# EAGLE design ECU_Board_itr1_v8_2025 (EAGLE 9.6.2)

## Sheet 1 of 3
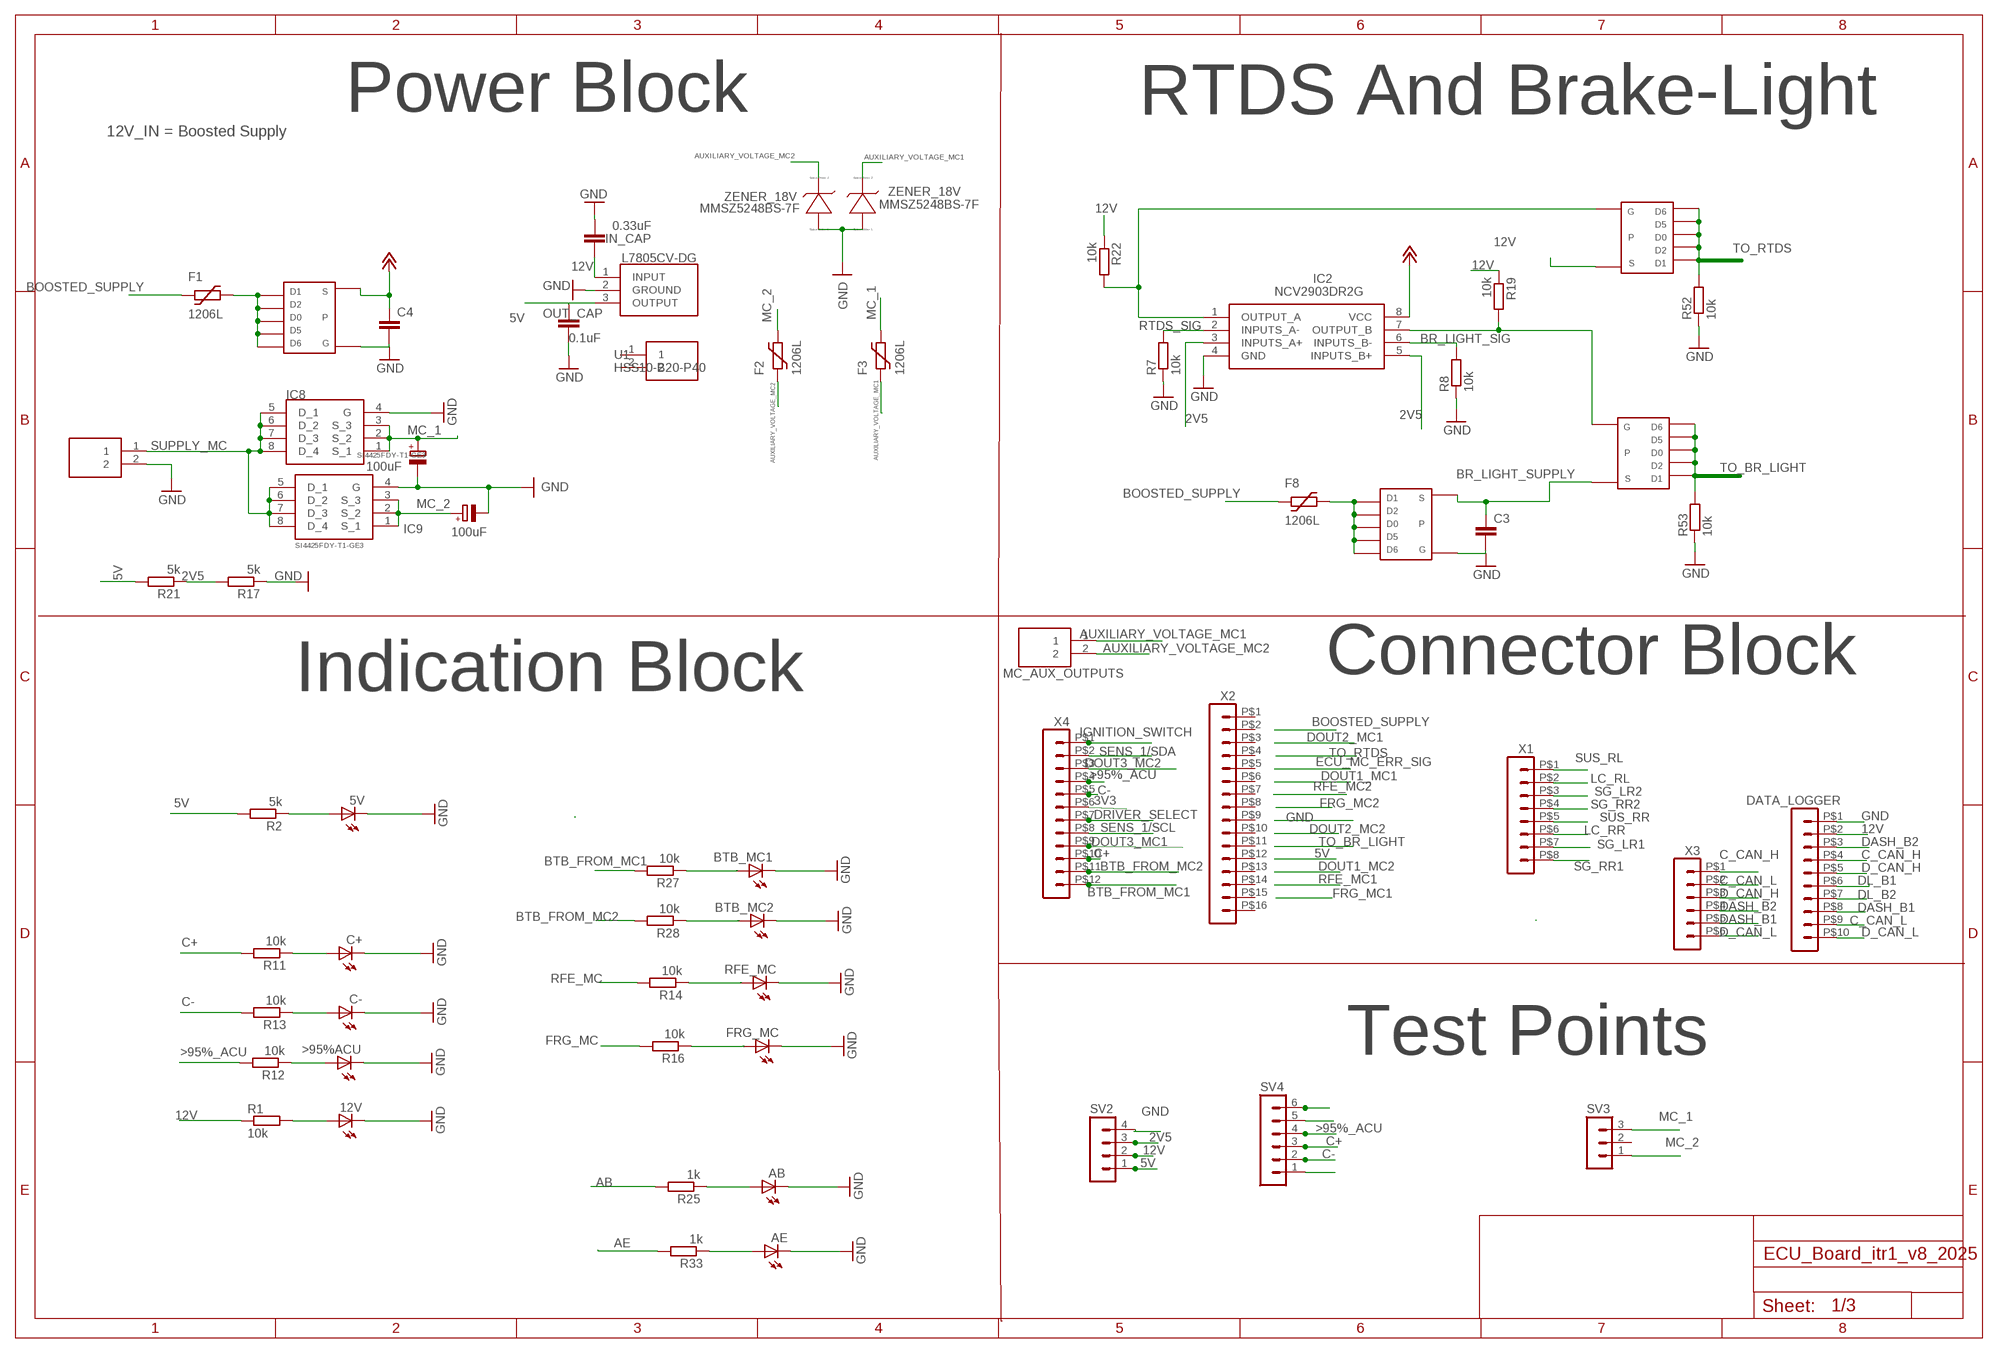
[diagram p0: schematic, sheet 1]

### Parts
5V  LED-FKIT-1206  [FKIT-LED-1206]
12V  LED-FKIT-1206  [FKIT-LED-1206]
>95%ACU  LED-FKIT-1206  [FKIT-LED-1206]
AB  LED-FKIT-1206  [FKIT-LED-1206]
AE  LED-FKIT-1206  [FKIT-LED-1206]
BOOSTED_SUPPLY1  172447-0002  [172447-YY02]
BTB_MC1  LED-FKIT-1206  [FKIT-LED-1206]
BTB_MC2  LED-FKIT-1206  [FKIT-LED-1206]
C3  C-EUC0805  [C0805]
C4  C-EUC0805  [C0805]
C7  100uF  CPOL-EUE2.5-6  [E2,5-6]
C8  100uF  CPOL-EUE2.5-6  [E2,5-6]
C+  LED-FKIT-1206  [FKIT-LED-1206]
C-  LED-FKIT-1206  [FKIT-LED-1206]
D4  ZENER  [SOD123]
D5  ZENER  [SOD123]
DATA_LOGGER  HEADER_POS10_43045-1012  [43045-1012]
F1  1206L  [1206L]
F2  1206L  [1206L]
F3  1206L  [1206L]
F8  1206L  [1206L]
FRG_MC  LED-FKIT-1206  [FKIT-LED-1206]
IC2  NCV2903DR2G  [SOIC127P600X175-8N]
IC4  L7805CV-DG  [TO255P460X1020X2008-3P]
IC8  SI4425FDY-T1-GE3  [SOIC127P600X175-8N]
IC9  SI4425FDY-T1-GE3  [SOIC127P600X175-8N]
IN_CAP  0.33uF  C-EUC0805  [C0805]
MC_AUX_OUTPUTS  172447-0002  [172447-YY02]
OUT_CAP  0.1uF  C-EUC0805  [C0805]
R1  10k  R-EU_R0805  [R0805]
R2  5k  R-EU_R0805  [R0805]
R7  10k  R-EU_R0805  [R0805]
R8  10k  R-EU_R0805  [R0805]
R11  10k  R-EU_R0805  [R0805]
R12  10k  R-EU_R0805  [R0805]
R13  10k  R-EU_R0805  [R0805]
R14  10k  R-EU_R0805  [R0805]
R16  10k  R-EU_R0805  [R0805]
R17  5k  R-EU_R0805  [R0805]
R19  10k  R-EU_R0805  [R0805]
R21  5k  R-EU_R0805  [R0805]
R22  10k  R-EU_R0805  [R0805]
R25  1k  R-EU_R0805  [R0805]
R27  10k  R-EU_R0805  [R0805]
R28  10k  R-EU_R0805  [R0805]
R33  1k  R-EU_R0805  [R0805]
R52  10k  R-EU_R0805  [R0805]
R53  10k  R-EU_R0805  [R0805]
RFE_MC  LED-FKIT-1206  [FKIT-LED-1206]
SV2  MA04-1  [MA04-1]
SV3  MA03-1  [MA03-1]
SV4  MA06-1  [MA06-1]
U1  HSS10-B20-P40  [HSS10B20P40]
U$1  TSOP-6_PMOS  [TSOP-6_PMOS]
U$13  TSOP-6_PMOS  [TSOP-6_PMOS]
U$16  TSOP-6_PMOS  [TSOP-6_PMOS]
U$17  TSOP-6_PMOS  [TSOP-6_PMOS]
X1  HEADER_POS8_44769-0801  [44769-0801]
X2  HEADER_POS16_44769-1601  [44769-1601]
X3  HEADER_POS6_43045-0612  [43045-0612]
X4  HEADER_POS12_44769-1201  [44769-1201]

### Nets
2V5: IC2.3(INPUTS_A+) IC2.5(INPUTS_B+) R17.2 R21.1 SV2.3 ; also sheet 2
3V3: SV4.1 X4.P$6 ; also sheet 2,3
5V: IC4.3(OUTPUT) OUT_CAP.1 R2.2 R21.2 SV2.1 ; also sheet 2
12V: C4.1 DATA_LOGGER.P$2 IC2.8(VCC) IC4.1(INPUT) IN_CAP.1 R1.1 R19.1 R22.1 SV2.2 U$13.S U$16.S ; supply symbol labelled +12V ; also sheet 2
>95%_ACU: R12.2 SV4.4 X4.P$4 ; also sheet 2
AB: R25.2 ; also sheet 2
AE: R33.2 ; also sheet 2
AUXILIARY_VOLTAGE_MC1: D4.C(-) F3.P$1 MC_AUX_OUTPUTS.1
AUXILIARY_VOLTAGE_MC2: D5.C(-) F2.P$1 MC_AUX_OUTPUTS.2
BOOSTED_SUPPLY: F1.P$1 F8.P$1
BR_LIGHT_SIG: IC2.6(INPUTS_B-) R8.2 ; also sheet 2
BR_LIGHT_SUPPLY: C3.1 U$1.S U$17.S
BTB_FROM_MC1: R27.2 X4.P$12 ; also sheet 2
BTB_FROM_MC2: R28.2 X4.P$11 ; also sheet 2
C+: R11.2 SV4.3 X4.P$10 ; also sheet 2
C-: R13.2 SV4.2 X4.P$5 ; also sheet 2
C_CAN_H: DATA_LOGGER.P$4 X3.P$1 ; also sheet 2
C_CAN_L: DATA_LOGGER.P$9 X3.P$2 ; also sheet 2
D_CAN_H: DATA_LOGGER.P$5 X3.P$3 ; also sheet 2
D_CAN_L: DATA_LOGGER.P$10 X3.P$6 ; also sheet 2
DASH_B1: DATA_LOGGER.P$8 X3.P$5
DASH_B2: DATA_LOGGER.P$3 X3.P$4
DL_B1: DATA_LOGGER.P$6 ; also sheet 2
DL_B2: DATA_LOGGER.P$7 ; also sheet 2
DOUT3_MC1: SV4.5 X4.P$9 ; also sheet 2
DOUT3_MC2: SV4.6 X4.P$3 ; also sheet 2
DRIVER_SELECT: X4.P$7 ; also sheet 2
FRG_MC: R16.2 ; also sheet 2
GND: 5V.C 12V.C >95%ACU.C AB.C AE.C BOOSTED_SUPPLY1.2 BTB_MC1.C BTB_MC2.C C3.2 C4.2 C7.- C8.- C+.C C-.C D4.A(+) D5.A(+) DATA_LOGGER.P$1 FRG_MC.C IC2.4(GND) IC4.2(GROUND) IC8.4(G) IC9.4(G) IN_CAP.2 OUT_CAP.2 R7.1 R8.1 R17.1 R52.1 R53.1 RFE_MC.C SV2.4 U$1.G U$13.G ; also sheet 2,3
IGNITION_SWITCH: X4.P$1 ; also sheet 2
LC_RL: X1.P$2 ; also sheet 2
LC_RR: X1.P$6 ; also sheet 2
MC_1: C7.+ F3.P$2 IC8.1(S_1) IC8.2(S_2) IC8.3(S_3) SV3.3
MC_2: C8.+ F2.P$2 IC9.1(S_1) IC9.2(S_2) IC9.3(S_3) SV3.1
N$1: 12V.A R1.2
N$2: R14.1 RFE_MC.A
N$3: AB.A R25.1
N$4: FRG_MC.A R16.1
N$5: IC2.1(OUTPUT_A) R22.2 U$16.G
N$6: 5V.A R2.1
N$7: IC2.7(OUTPUT_B) R19.2 U$17.G
N$8: AE.A R33.1
N$10: F8.P$2 U$1.1 U$1.2 U$1.5 U$1.6 U$1.D(D0)
N$15: C+.A R11.1
N$16: >95%ACU.A R12.1
N$17: C-.A R13.1
N$18: BTB_MC1.A R27.1
N$31: BTB_MC2.A R28.1
N$46: F1.P$2 U$13.1 U$13.2 U$13.5 U$13.6 U$13.D(D0)
RFE_MC: R14.2 ; also sheet 2
RTDS_SIG: IC2.2(INPUTS_A-) R7.2 ; also sheet 2
SENS_1/SCL: X4.P$8 ; also sheet 3
SENS_1/SDA: X4.P$2 ; also sheet 3
SG_LR1: X1.P$7 ; also sheet 2
SG_LR2: X1.P$3 ; also sheet 2
SG_RR1: X1.P$8 ; also sheet 2
SG_RR2: X1.P$4 ; also sheet 2
SUPPLY_MC: BOOSTED_SUPPLY1.1 IC8.5(D_1) IC8.6(D_2) IC8.7(D_3) IC8.8(D_4) IC9.5(D_1) IC9.6(D_2) IC9.7(D_3) IC9.8(D_4)
SUS_RL: X1.P$1 ; also sheet 2
SUS_RR: X1.P$5 ; also sheet 2
TO_BR_LIGHT: R53.2 U$17.1 U$17.2 U$17.5 U$17.6 U$17.D(D0)
TO_RTDS: R52.2 U$16.1 U$16.2 U$16.5 U$16.6 U$16.D(D0)
Unconnected: SV3.2 U1.1 U1.2 X2.P$1 X2.P$2 X2.P$3 X2.P$4 X2.P$5 X2.P$6 X2.P$7 X2.P$8 X2.P$9 X2.P$10 X2.P$11 X2.P$12 X2.P$13 X2.P$14 X2.P$15 X2.P$16

### Notes on the sheet
- Power Block | RTDS And Brake-Light
- 12V_IN = Boosted Supply
- Indication Block | Connector Block
- Test Points

## Sheet 2 of 3
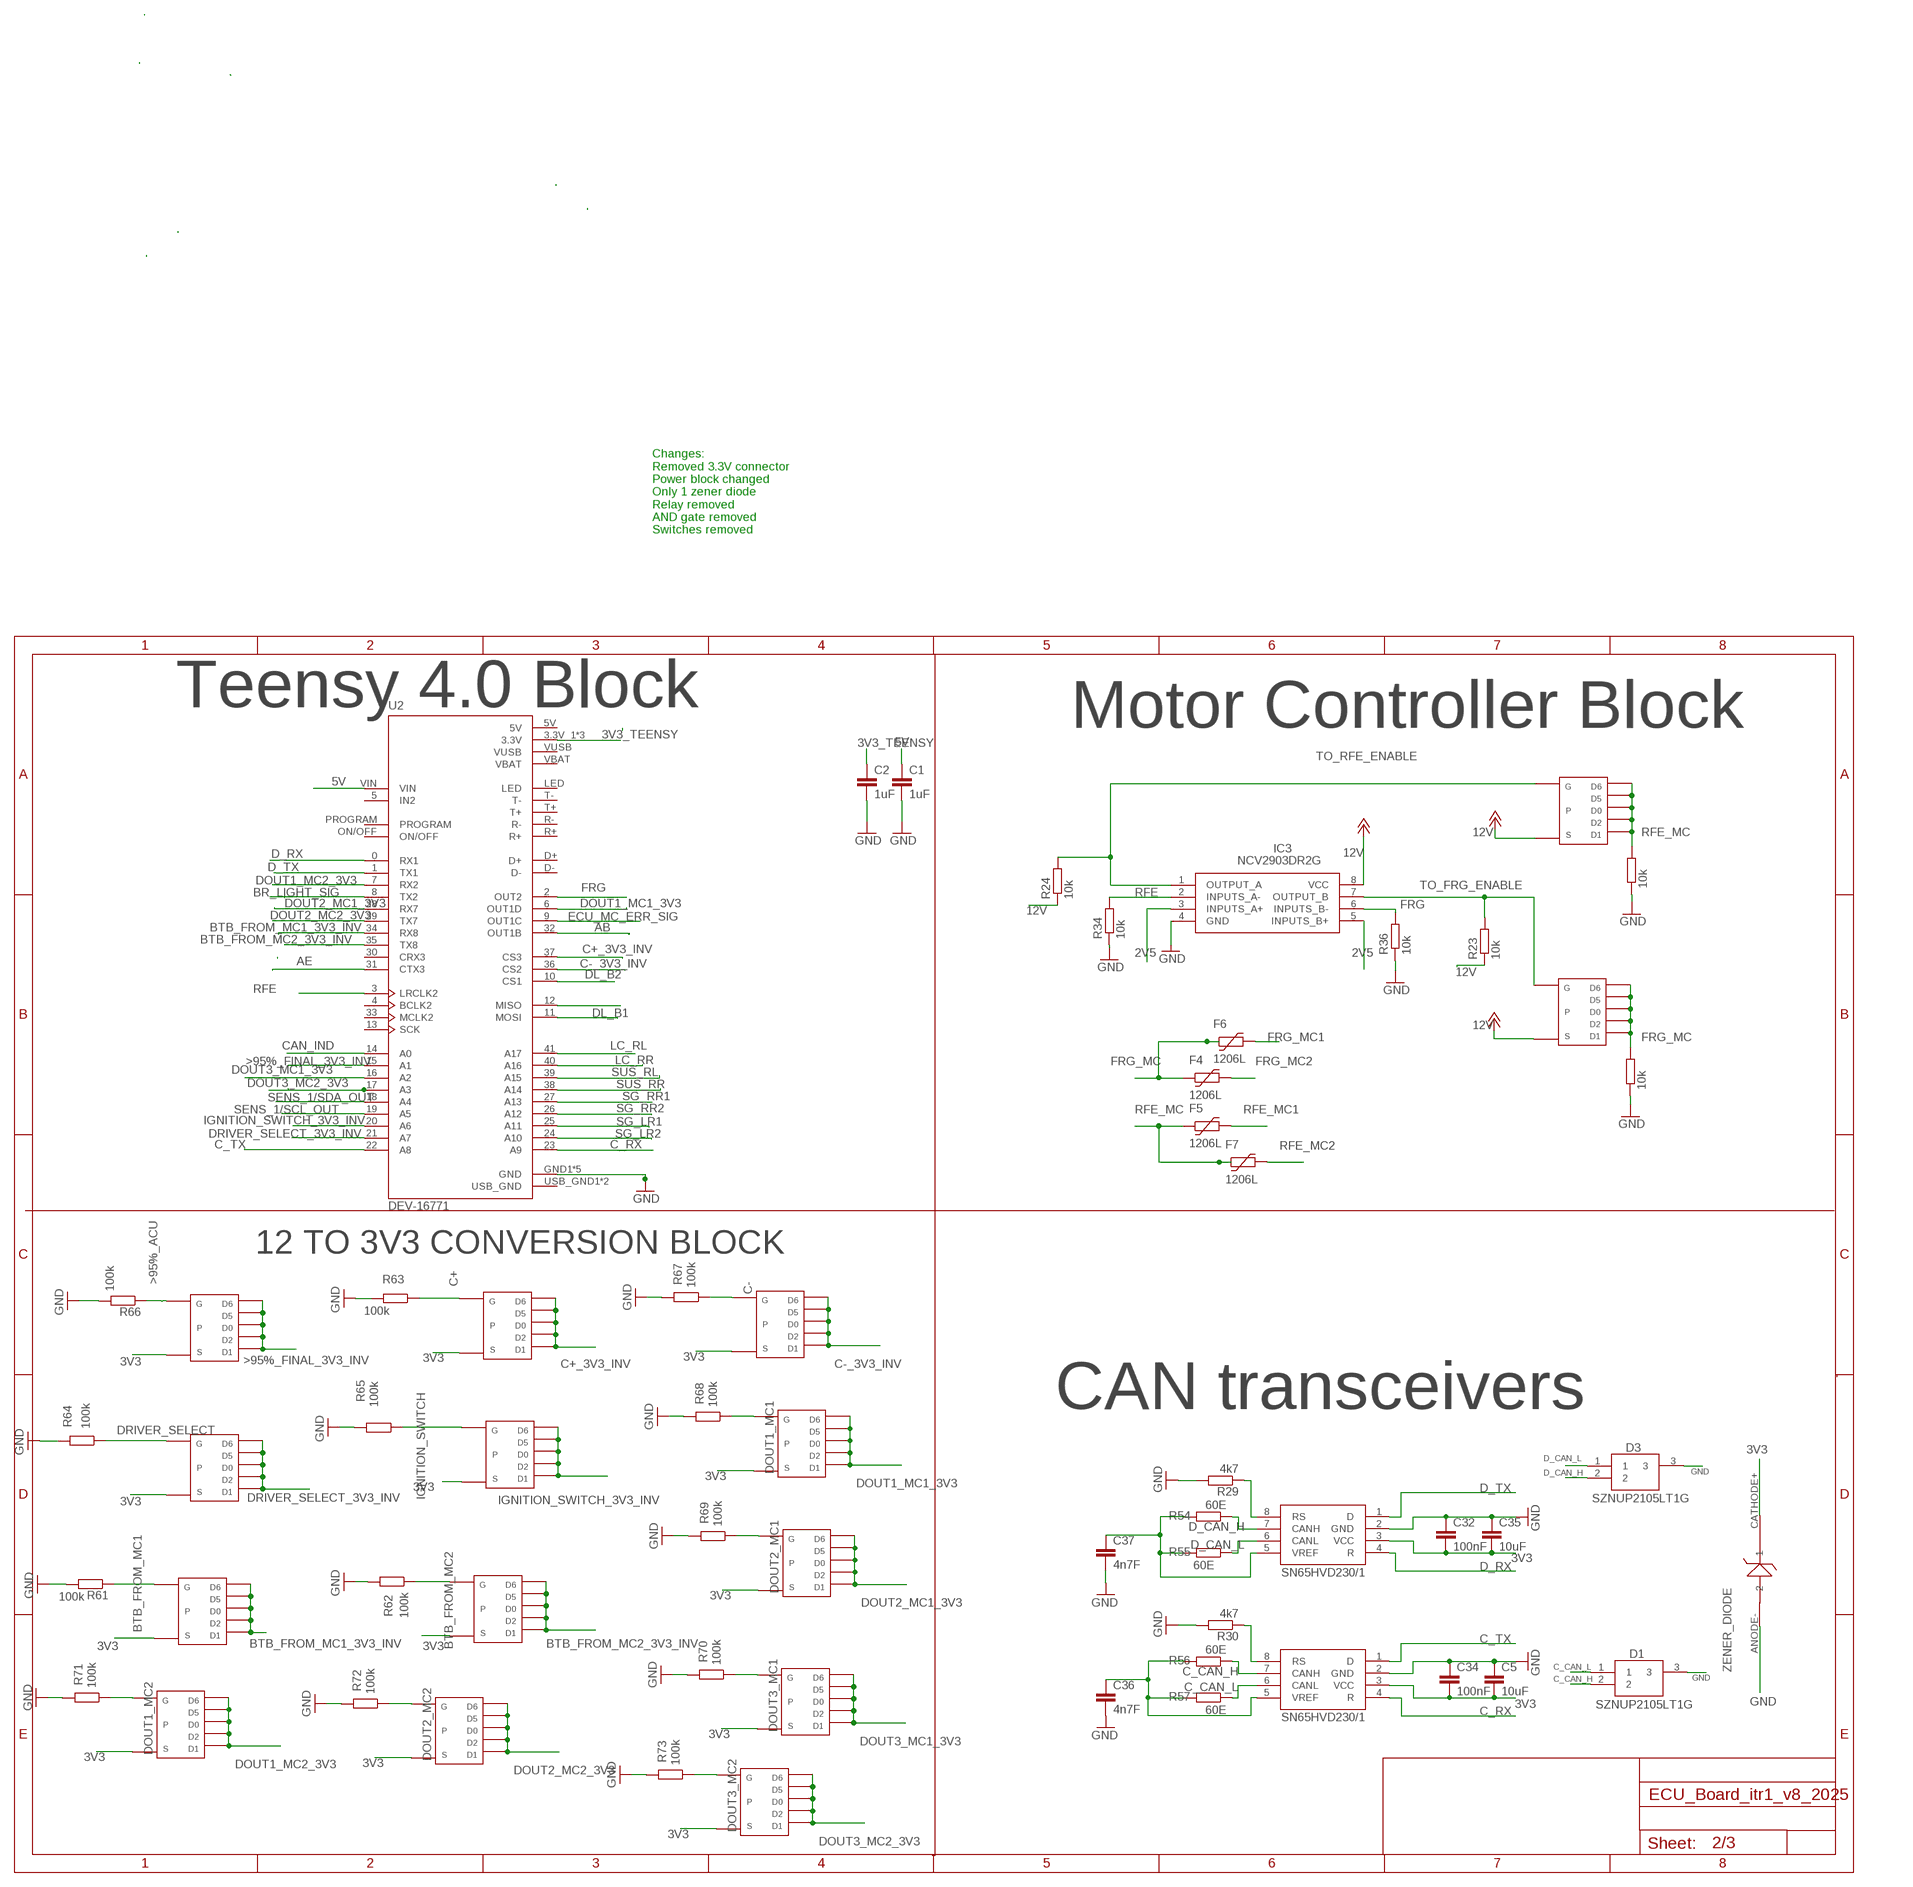
[diagram p1: schematic, sheet 2]

### Parts
C1  1uF  C-EUC0805  [C0805]
C2  1uF  C-EUC0805  [C0805]
C5  10uF  C-EUC0805  [C0805]
C32  100nF  C-EUC0805  [C0805]
C34  100nF  C-EUC0805  [C0805]
C35  10uF  C-EUC0805  [C0805]
C36  4n7F  C-EUC0805  [C0805]
C37  4n7F  C-EUC0805  [C0805]
D1  SZNUP2105LT1G  [SOT96P237X111-3N]
D3  SZNUP2105LT1G  [SOT96P237X111-3N]
F4  1206L  [1206L]
F5  1206L  [1206L]
F6  1206L  [1206L]
F7  1206L  [1206L]
IC3  NCV2903DR2G  [SOIC127P600X175-8N]
R23  10k  R-EU_R0805  [R0805]
R24  10k  R-EU_R0805  [R0805]
R29  4k7  R-EU_R0805  [R0805]
R30  4k7  R-EU_R0805  [R0805]
R31  10k  R-EU_R0805  [R0805]
R32  10k  R-EU_R0805  [R0805]
R34  10k  R-EU_R0805  [R0805]
R36  10k  R-EU_R0805  [R0805]
R54  60E  R-EU_R0805  [R0805]
R55  60E  R-EU_R0805  [R0805]
R56  60E  R-EU_R0805  [R0805]
R57  60E  R-EU_R0805  [R0805]
R61  100k  R-EU_R0805  [R0805]
R62  100k  R-EU_R0805  [R0805]
R63  100k  R-EU_R0805  [R0805]
R64  100k  R-EU_R0805  [R0805]
R65  100k  R-EU_R0805  [R0805]
R66  100k  R-EU_R0805  [R0805]
R67  100k  R-EU_R0805  [R0805]
R68  100k  R-EU_R0805  [R0805]
R69  100k  R-EU_R0805  [R0805]
R70  100k  R-EU_R0805  [R0805]
R71  100k  R-EU_R0805  [R0805]
R72  100k  R-EU_R0805  [R0805]
R73  100k  R-EU_R0805  [R0805]
U2  DEV-16771  [MODULE_DEV-16771]
U$7  SN65HVD230/1  [SO8]
U$8  SN65HVD230/1  [SO8]
U$14  TSOP-6_PMOS  [TSOP-6_PMOS]
U$15  TSOP-6_PMOS  [TSOP-6_PMOS]
U$20  ZENER_DIODE  [SOD323HE]
U$24  TSOP-6_PMOS  [TSOP-6_PMOS]
U$25  TSOP-6_PMOS  [TSOP-6_PMOS]
U$26  TSOP-6_PMOS  [TSOP-6_PMOS]
U$27  TSOP-6_PMOS  [TSOP-6_PMOS]
U$28  TSOP-6_PMOS  [TSOP-6_PMOS]
U$29  TSOP-6_PMOS  [TSOP-6_PMOS]
U$30  TSOP-6_PMOS  [TSOP-6_PMOS]
U$31  TSOP-6_PMOS  [TSOP-6_PMOS]
U$32  TSOP-6_PMOS  [TSOP-6_PMOS]
U$33  TSOP-6_PMOS  [TSOP-6_PMOS]
U$34  TSOP-6_PMOS  [TSOP-6_PMOS]
U$35  TSOP-6_PMOS  [TSOP-6_PMOS]
U$36  TSOP-6_PMOS  [TSOP-6_PMOS]

### Nets
2V5: IC3.3(INPUTS_A+) IC3.5(INPUTS_B+) ; also sheet 1
3V3: C5.2 C32.2 C34.2 C35.2 U$7.3(VCC) U$8.3(VCC) U$20.CATHODE+ U$24.S U$25.S U$26.S U$27.S U$28.S U$29.S U$30.S U$31.S U$32.S U$33.S U$34.S U$35.S U$36.S ; also sheet 1,3
3V3_TEENSY: C2.1 U2.3.3V_1(3.3V) U2.3.3V_2(3.3V) U2.3.3V_3(3.3V) ; also sheet 3
5V: C1.1 U2.VIN ; also sheet 1
12V: IC3.8(VCC) R23.1 R24.1 U$14.S U$15.S ; supply symbol labelled +12V ; also sheet 1
>95%_ACU: R66.1 U$25.G ; also sheet 1
>95%_FINAL_3V3_INV: U2.15(A1) U$25.1 U$25.2 U$25.5 U$25.6 U$25.D(D0)
AB: U2.32(OUT1B) ; also sheet 1
AE: U2.31(CTX3) ; also sheet 1
BR_LIGHT_SIG: U2.8(TX2) ; also sheet 1
BTB_FROM_MC1: R61.1 U$27.G ; also sheet 1
BTB_FROM_MC1_3V3_INV: U2.34(RX8) U$27.1 U$27.2 U$27.5 U$27.6 U$27.D(D0)
BTB_FROM_MC2: R62.1 U$26.G ; also sheet 1
BTB_FROM_MC2_3V3_INV: U2.35(TX8) U$26.1 U$26.2 U$26.5 U$26.6 U$26.D(D0)
C+: R63.1 U$24.G ; also sheet 1
C+_3V3_INV: U2.37(CS3) U$24.1 U$24.2 U$24.5 U$24.6 U$24.D(D0)
C-: R67.1 U$30.G ; also sheet 1
C-_3V3_INV: U2.36(CS2) U$30.1 U$30.2 U$30.5 U$30.6 U$30.D(D0)
C_CAN_H: D1.2 R56.1 U$7.7(CANH) ; also sheet 1
C_CAN_L: D1.1 R57.1 U$7.6(CANL) ; also sheet 1
C_RX: U2.23(A9) U$7.4(R)
C_TX: U2.22(A8) U$7.1(D)
CAN_IND: U2.14(A0)
D_CAN_H: D3.2 R54.1 U$8.7(CANH) ; also sheet 1
D_CAN_L: D3.1 R55.1 U$8.6(CANL) ; also sheet 1
D_RX: U2.0(RX1) U$8.4(R)
D_TX: U2.1(TX1) U$8.1(D)
DL_B1: U2.11(MOSI) ; also sheet 1
DL_B2: U2.10(CS1) ; also sheet 1
DOUT1_MC1: R68.1 U$31.G ; also sheet 1
DOUT1_MC1_3V3: U2.6(OUT1D) U$31.1 U$31.2 U$31.5 U$31.6 U$31.D(D0)
DOUT1_MC2: R71.1 U$34.G ; also sheet 1
DOUT1_MC2_3V3: U2.7(RX2) U$34.1 U$34.2 U$34.5 U$34.6 U$34.D(D0)
DOUT2_MC1: R69.1 U$32.G ; also sheet 1
DOUT2_MC1_3V3: U2.28(RX7) U$32.1 U$32.2 U$32.5 U$32.6 U$32.D(D0)
DOUT2_MC2: R72.1 U$35.G ; also sheet 1
DOUT2_MC2_3V3: U2.29(TX7) U$35.1 U$35.2 U$35.5 U$35.6 U$35.D(D0)
DOUT3_MC1: R70.1 U$33.G ; also sheet 1
DOUT3_MC1_3V3: U2.16(A2) U$33.1 U$33.2 U$33.5 U$33.6 U$33.D(D0)
DOUT3_MC2: R73.1 U$36.G ; also sheet 1
DOUT3_MC2_3V3: U2.17(A3) U$36.1 U$36.2 U$36.5 U$36.6 U$36.D(D0)
DRIVER_SELECT: R64.1 U$29.G ; also sheet 1
DRIVER_SELECT_3V3_INV: U2.21(A7) U$29.1 U$29.2 U$29.5 U$29.6 U$29.D(D0)
ECU_MC_ERR_SIG: U2.9(OUT1C) ; also sheet 1
FRG: IC3.6(INPUTS_B-) R36.2 U2.2(OUT2)
FRG_MC: F4.P$1 F6.P$1 R32.2 U$15.1 U$15.2 U$15.5 U$15.6 U$15.D(D0) ; also sheet 1
FRG_MC1: F6.P$2 ; also sheet 1
FRG_MC2: F4.P$2 ; also sheet 1
GND: C1.2 C2.2 C5.1 C32.1 C34.1 C35.1 C36.2 C37.2 D1.3 D3.3 IC3.4(GND) R29.2 R30.2 R31.1 R32.1 R34.1 R36.1 R61.2 R62.2 R63.2 R64.2 R65.2 R66.2 R67.2 R68.2 R69.2 R70.2 R71.2 R72.2 R73.2 U2.GND1(GND) U2.GND2(GND) U2.GND3(GND) U2.GND4(GND) U2.GND5(GND) U$7.2(GND) U$8.2(GND) U$20.ANODE- ; also sheet 1,3
IGNITION_SWITCH: R65.1 U$28.G ; also sheet 1
IGNITION_SWITCH_3V3_INV: U2.20(A6) U$28.1 U$28.2 U$28.5 U$28.6 U$28.D(D0)
LC_RL: U2.41(A17) ; also sheet 1
LC_RR: U2.40(A16) ; also sheet 1
N$32: R29.1 U$8.8(RS)
N$33: C37.1 R54.2 R55.2 U$8.5(VREF)
N$35: C36.1 R56.2 R57.2 U$7.5(VREF)
N$37: R30.1 U$7.8(RS)
RFE: IC3.2(INPUTS_A-) R34.2 U2.3(LRCLK2)
RFE_MC: F5.P$1 F7.P$1 R31.2 U$14.1 U$14.2 U$14.5 U$14.6 U$14.D(D0) ; also sheet 1
RFE_MC1: F5.P$2 ; also sheet 1
RFE_MC2: F7.P$2 ; also sheet 1
RTDS_SIG: U2.12(MISO) ; also sheet 1
SENS_1/SCL_OUT: U2.19(A5) ; also sheet 3
SENS_1/SDA_OUT: U2.18(A4) ; also sheet 3
SG_LR1: U2.25(A11) ; also sheet 1
SG_LR2: U2.24(A10) ; also sheet 1
SG_RR1: U2.27(A13) ; also sheet 1
SG_RR2: U2.26(A12) ; also sheet 1
SUS_RL: U2.39(A15) ; also sheet 1
SUS_RR: U2.38(A14) ; also sheet 1
TO_FRG_ENABLE: IC3.7(OUTPUT_B) R23.2 U$15.G
TO_RFE_ENABLE: IC3.1(OUTPUT_A) R24.2 U$14.G
Unconnected: U2.4(BCLK2) U2.5(IN2) U2.13(SCK) U2.30(CRX3) U2.33(MCLK2) U2.D+ U2.D- U2.LED U2.ON/OFF U2.PROGRAM U2.R+ U2.R- U2.T+ U2.T- U2.VBAT U2.VUSB

### Notes on the sheet
- Changes:
  Removed 3.3V connector
  Power block changed
  Only 1 zener diode
  Relay removed
  AND gate removed
  Switches removed
- Teensy 4.0 Block
- Motor Controller Block
- 12 TO 3V3 CONVERSION BLOCK
- CAN transceivers

## Sheet 3 of 3
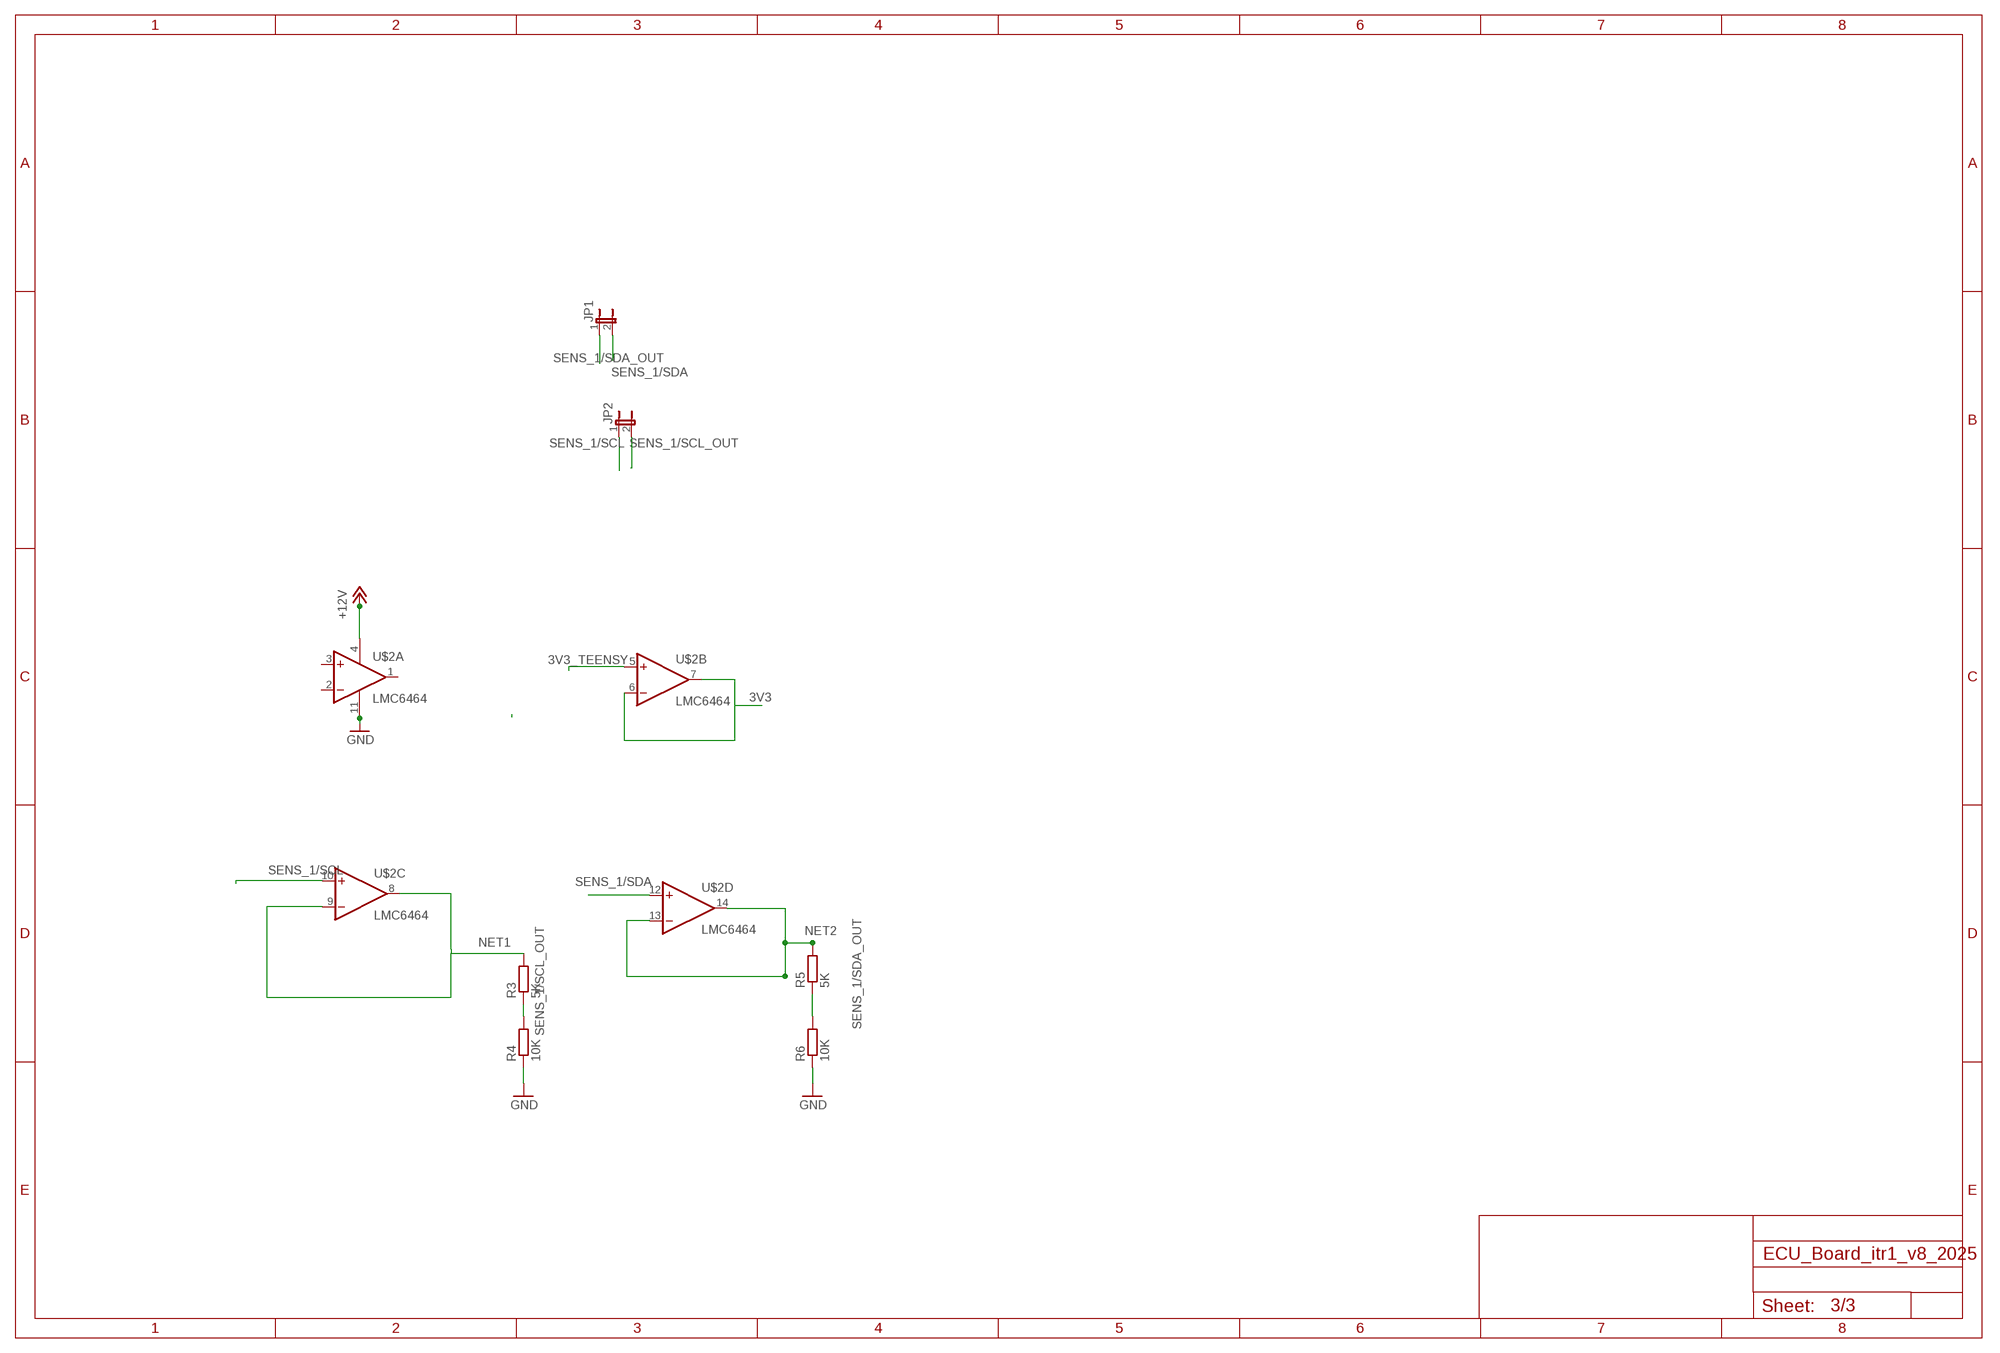
[diagram p2: schematic, sheet 3]

### Parts
JP1  JP1E  [JP1]
JP2  JP1E  [JP1]
R3  5K  R-EU_R0805  [R0805]
R4  10K  R-EU_R0805  [R0805]
R5  5K  R-EU_R0805  [R0805]
R6  10K  R-EU_R0805  [R0805]
U$2  LMC6464  [SO14_LONGPADS]

### Nets
3V3: U$2.6(B:-IN) U$2.7(B:OUT) ; also sheet 1,2
3V3_TEENSY: U$2.5(B:+IN) ; also sheet 2
+12V: U$2.4(POW:V+)
GND: R4.1 R6.1 U$2.11(POW:V-) ; also sheet 1,2
NET1: R3.2 U$2.8(C:OUT) U$2.9(C:-IN)
NET2: R5.2 U$2.13(D:-IN) U$2.14(D:OUT)
SENS_1/SCL: JP2.1 U$2.10(C:+IN) ; also sheet 1
SENS_1/SCL_OUT: JP2.2 R3.1 R4.2 ; also sheet 2
SENS_1/SDA: JP1.2 U$2.12(D:+IN) ; also sheet 1
SENS_1/SDA_OUT: JP1.1 R5.1 R6.2 ; also sheet 2
Unconnected: U$2.1(A:OUT) U$2.2(A:-IN) U$2.3(A:+IN)

## Power pins joined to a net without a drawn wire
5V: U2.5V
USB_GND: U2.USB_GND1(USB_GND) U2.USB_GND2(USB_GND)

## Library data of the parts
5V 12V >95%ACU AB AE BTB_MC1 BTB_MC2 C+ C- FRG_MC RFE_MC = IIT_BOMBAY_Racing:LED: LEDs Standard schematic elements and footprints for 5mm, 3mm, 1206, and 0603 sized LEDs. 5mm - Spark Fun Electronics SKU : COM-00529 (and others)
BOOSTED_SUPPLY1 MC_AUX_OUTPUTS = 172447-0002:172447-0002: Mini-Fit Jr. Header, Dual Row, Vertical, with Snap-in Plastic Peg PCB Lock, 2 Circuits, Nylon 6/6, UL 94V-2, Glow-Wire Capable Source: Datasheet <https://www.molex.com/pdm_docs/sd/1724470002_sd.pdf>; DESCRIPTION: Mini-Fit Jr. Header, Dual Row, Vertical, with Snap-in Plastic Peg PCB Lock, 2 Circuits, Nylon 6/6, UL 94V-2, Glow-Wire Capable; HEIGHT: 12.8mm; MANUFACTURER_NAME: Molex; MANUFACTURER_PART_NUMBER: 172447-0002; MOUSER_PART_NUMBER: 538-172447-0002; MOUSER_PRICE-STOCK: https://www.mouser.co.uk/ProductDetail/Molex/172447-0002?qs=%2FstZWcIQ8mj0J1Oi8cYlzQ%3D%3D
C1-C5 C32 C34-C37 IN_CAP OUT_CAP = IIT_BOMBAY_Racing:C-EU: CAPACITOR, European symbol
C7 C8 = IIT_BOMBAY_Racing:CPOL-EU: POLARIZED CAPACITOR, European symbol
D1 D3 = SamacSys_Parts:SZNUP2105LT1G: Dual Bi-Directional TVS Diode, 350W peak, 3-pin SOT-23 Source: Datasheet <http://www.onsemi.com/pub/Collateral/NUP2105L-D.PDF>; DESCRIPTION: Dual Bi-Directional TVS Diode, 350W peak, 3-pin SOT-23; HEIGHT: 1.11mm; MANUFACTURER_NAME: ON Semiconductor; MANUFACTURER_PART_NUMBER: SZNUP2105LT1G; MOUSER_PART_NUMBER: 863-SZNUP2105LT1G; MOUSER_PRICE-STOCK: https://www.mouser.co.uk/ProductDetail/ON-Semiconductor/SZNUP2105LT1G?qs=PJJcWtbOkNWqqZbXH80dfQ%3D%3D
D4 D5 = sym:ZENER: Zener Diode
DATA_LOGGER = IIT_BOMBAY_Racing2:HEADER_POS10_?: Molex - Micro-Fit 3.0 Series connector, 3.00mm (0.118") pitch header, 10 positions.
F1-F8 = IIT_BOMBAY_Racing:1206L
IC2 IC3 = comparators:NCV2903DR2G: ON Semiconductor NCV2903DR2G Dual Comparator, CMOS/TTL O/P, 1.5us 2 36 V dc 8-Pin SOIC Source: Datasheet <http://www.onsemi.com/pub/Collateral/LM393-D.PDF>; DESCRIPTION: ON Semiconductor NCV2903DR2G Dual Comparator, CMOS/TTL O/P, 1.5us 2 36 V dc 8-Pin SOIC; HEIGHT: 1.75mm; MANUFACTURER_NAME: onsemi; MANUFACTURER_PART_NUMBER: NCV2903DR2G; MOUSER_PART_NUMBER: 863-NCV2903DR2G; MOUSER_PRICE-STOCK: https://www.mouser.co.uk/ProductDetail/onsemi/NCV2903DR2G?qs=8sOby8ZxZLHCHCHBLVGsJQ%3D%3D
IC4 = SamacSys_Parts:L7805CV-DG: Voltage Regulator 5V 4% 1.5A TO220 L7805CV-DG, Linear Voltage Regulator, Current Limit, Shut-Down 1.5A 5 V, 3-Pin TO220 Source: Datasheet <http://www.st.com/web/en/resource/technical/document/datasheet/CD00000444.pdf>; DESCRIPTION: Voltage Regulator 5V 4% 1.5A TO220 L7805CV-DG, Linear Voltage Regulator, Current Limit, Shut-Down 1.5A 5 V, 3-Pin TO220; HEIGHT: 4.6mm; MANUFACTURER_NAME: STMicroelectronics; MANUFACTURER_PART_NUMBER: L7805CV-DG; MOUSER_PART_NUMBER: 511-L7805CV-DG; MOUSER_PRICE-STOCK: https://www.mouser.co.uk/ProductDetail/STMicroelectronics/L7805CV-DG?qs=T%2FOtf55vL7c3O0as9P9fAw%3D%3D
IC8 IC9 = SamacSys_Parts:SI4425FDY-T1-GE3: MOSFET P-CHANNEL 30-V (D-S) MOSFET Source: Datasheet <https://www.vishay.com/docs/77095/si4425fdy.pdf>; DESCRIPTION: MOSFET P-CHANNEL 30-V (D-S) MOSFET; HEIGHT: 1.75mm; MANUFACTURER_NAME: Vishay; MANUFACTURER_PART_NUMBER: SI4425FDY-T1-GE3; MOUSER_PART_NUMBER: 78-SI4425FDY-T1-GE3; MOUSER_PRICE-STOCK: https://www.mouser.co.uk/ProductDetail/Vishay-Siliconix/SI4425FDY-T1-GE3?qs=%252B6g0mu59x7IUQKSn86z1oQ%3D%3D
JP1 JP2 = jumper:JP1E: JUMPER
R1 R17 R21 = rcl:R-EU_: RESISTOR, European symbol; SPICEPREFIX: R
R2-R8 R11-R14 R16 R19 R22-R25 R27-R34 R36 R52-R57 R61-R73 = IIT_BOMBAY_Racing:R-EU_: RESISTOR, European symbol
SV2 = con-lstb:MA04-1: PIN HEADER; OC_FARNELL: unknown; OC_NEWARK: unknown
SV3 = con-lstb:MA03-1: PIN HEADER; OC_FARNELL: unknown; OC_NEWARK: unknown
SV4 = con-lstb:MA06-1: PIN HEADER; OC_FARNELL: unknown; OC_NEWARK: unknown
U1 = SamacSys_Parts:HSS10-B20-P40: Heat Sinks heat sink, stamping, TO-220, 29.97 x 25. Source: Datasheet <https://www.cuidevices.com/product/resource/hss10-b20-p40.pdf>; DESCRIPTION: Heat Sinks heat sink, stamping, TO-220, 29.97 x 25.; HEIGHT: 29.97mm; MANUFACTURER_NAME: CUI Inc.; MANUFACTURER_PART_NUMBER: HSS10-B20-P40; MOUSER_PART_NUMBER: 490-HSS10-B20-P40; MOUSER_PRICE-STOCK: https://www.mouser.co.uk/ProductDetail/CUI-Devices/HSS10-B20-P40?qs=QNEnbhJQKvYYvwy4FCjq1A%3D%3D
U2 = DEV-16771:DEV-16771: RT1062 Teensy 4.1 i.MX ARM Cortex-M7 MPU Embedded Evaluation Board; CHECK_PRICES: https://www.snapeda.com/parts/DEV-16771/SparkFun+Electronics/view-part/?ref=eda; DESCRIPTION: RT1062 Teensy 4.1 series ARM® Cortex®-M7 MPU Embedded Evaluation Board; DIGIKEY_PART_NUMBER: 1568-DEV-16771-ND; MF: SparkFun Electronics; MP: DEV-16771; PACKAGE: None; PURCHASE-URL: https://www.snapeda.com/api/url_track_click_mouser/?unipart_id=4833875&manufacturer=SparkFun Electronics&part_name=DEV-16771&search_term=teensy 4.1; SNAPEDA_LINK: https://www.snapeda.com/parts/DEV-16771/SparkFun+Electronics/view-part/?ref=snap
U$1 U$13-U$17 U$24-U$36 = TSOP-6_MOS:TSOP-6_PMOS
U$2 = IIT_BOMBAY_Racing:LMC6464
U$7 U$8 = texas_1:SN65HVD230/1
U$20 = mylib:ZENER_DIODE
X1 = IIT_BOMBAY_Racing:HEADER_POS8_?: Molex - Micro-Fit 3.0 Series connector, 3.00mm (0.118") pitch header, 8 positions.
X2 = IIT_BOMBAY_Racing:HEADER_POS16_?: Molex - Micro-Fit 3.0 Series connector, 3.00mm (0.118") pitch header, 16 positions.
X3 = IIT_BOMBAY_Racing:HEADER_POS6_?: Molex - Micro-Fit 3.0 Series connector, 3.00mm (0.118") pitch header, 6 positions.
X4 = IIT_BOMBAY_Racing:HEADER_POS12_?: Molex - Micro-Fit 3.0 Series connector, 3.00mm (0.118") pitch header, 12 positions.

## Board
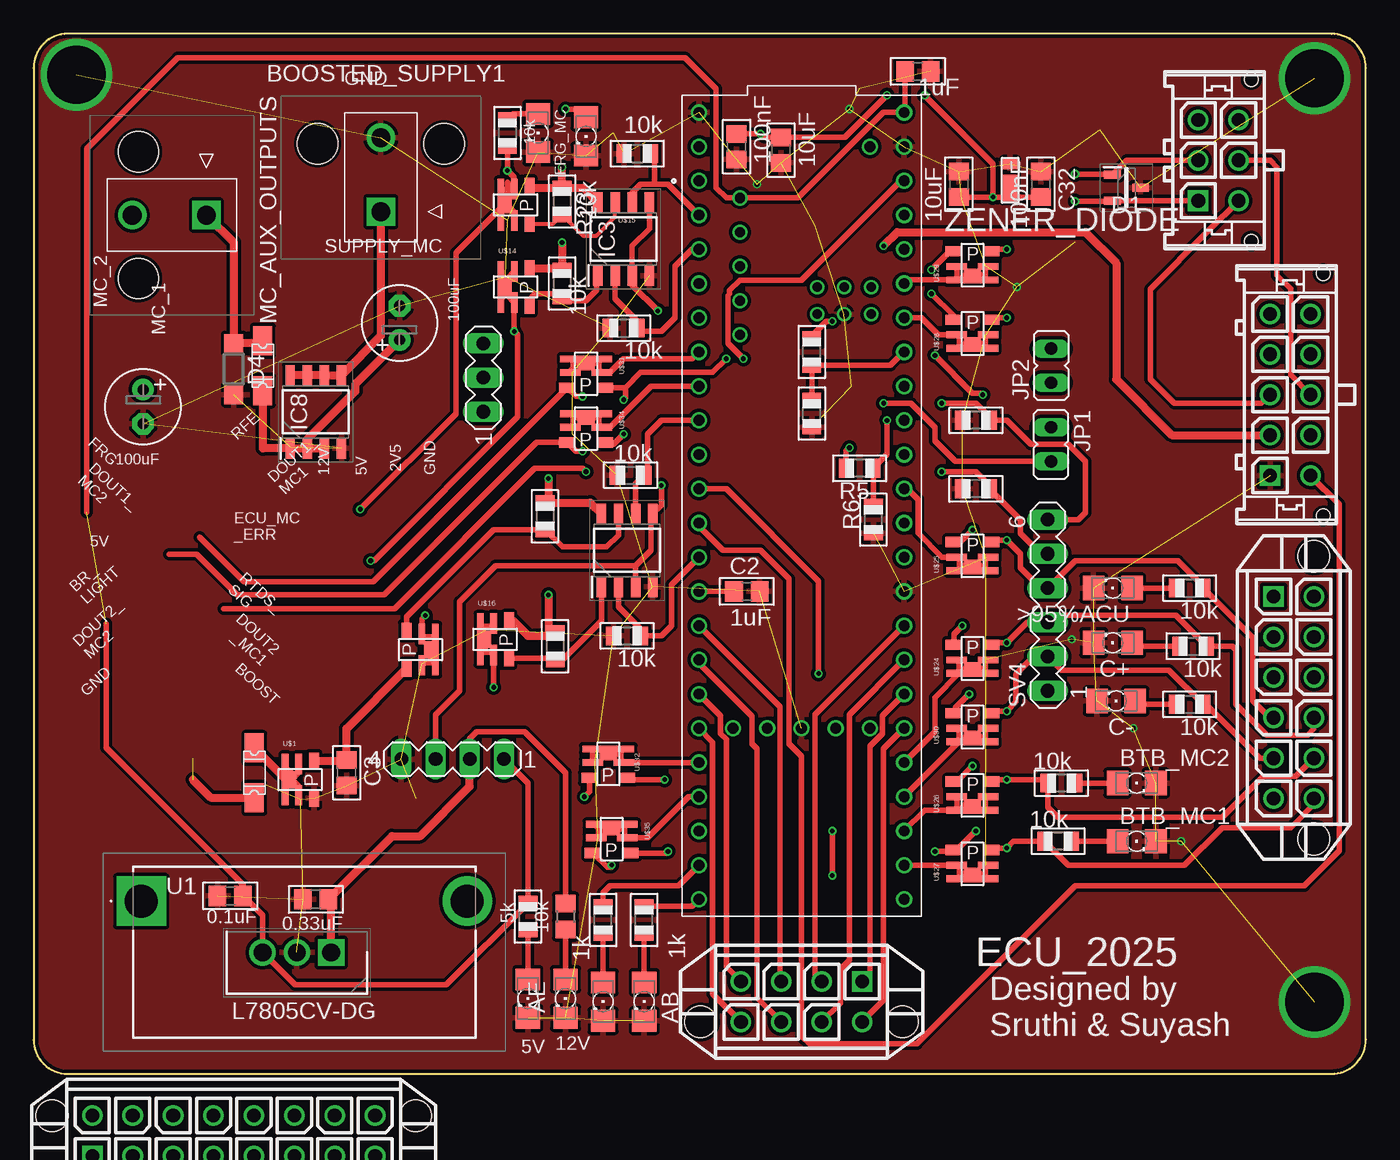
[diagram p3: board, top side]
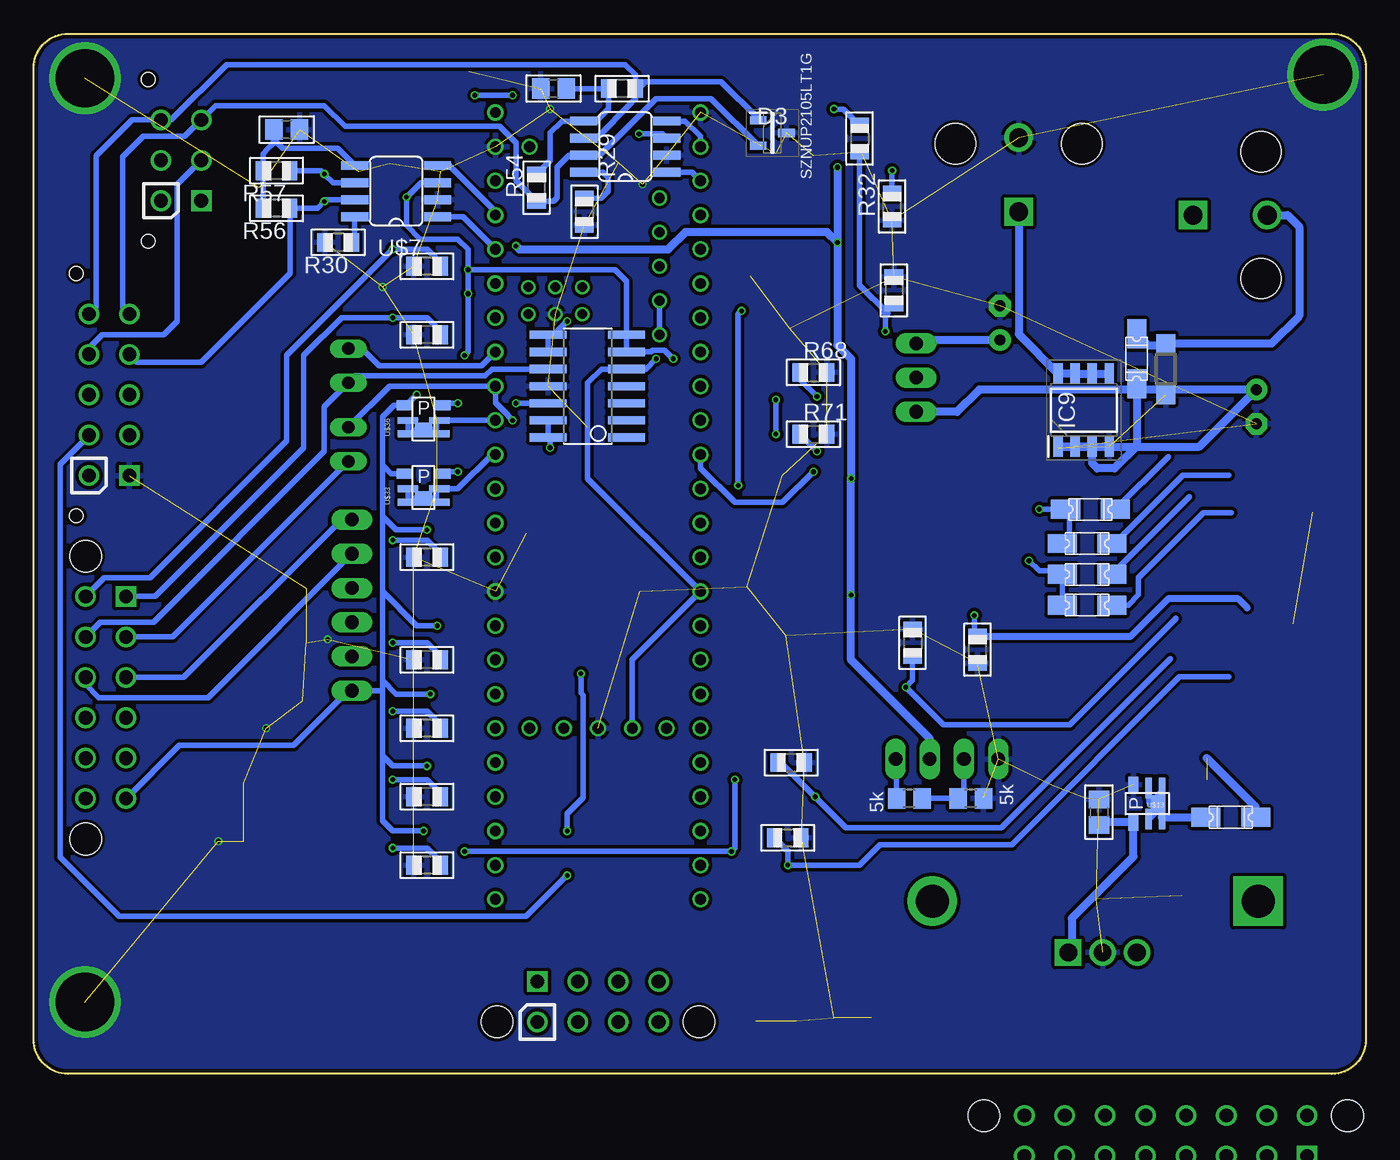
[diagram p4: board, bottom side, seen from below]

Size 98.93 x 77.23 mm. Coordinates in mm from the lower left corner, seen from the top.
Outline: 2.53,0 96.39,0.01 arc90 98.93,2.55 98.93,74.68 arc90 96.39,77.22 2.53,77.23 arc90 0,74.69 0,2.54 arc90 2.53,0
Copper layers (1*16): Top 0.035mm / dielectric 1.5mm / Bottom 0.035mm
Design rules "PCB_Power": minimum track width 5mil, minimum drill 10mil, track to track 5mil, track to pad 5mil, pad to pad 5mil, via to via 5mil, smd to smd 5mil, copper to edge 10mil, drill to drill 6mil, minimum pad ring 5mil, minimum via ring 5mil, stop-mask expansion 3mil, vias tented up to drill 0mil, thermal gap 10mil

### Footprints (pad centres in the part's own frame; a part is rotated, then mirrored left to right if it is on the bottom)
FKIT-LED-1206 = smd 1.6 x 1.803: A -1.422,0; C 1.422,0
172447-YY02 = drill 1.4 pad 1.9 square: 1 0,0 | drill 1.4 pad 1.9: 2 0,5.5 | hole 3: 4.7,5.04; -4.7,5.04
C0805 = smd 1.3 x 1.5: 1 -0.95,0; 2 0.95,0
E2,5-6 = drill 0.813 pad 1.6: + -1.27,0 | drill 0.813 pad 1.6 octagon: - 1.27,0
SOT96P237X111-3N = smd 1.25 x 0.6: 1 -1.05,0.955; 2 -1.05,-0.955; 3 1.05,0
SOD123 = smd 1.4 x 1.4: A 1.9,0; C -1.9,0
43045-1012 = drill 1.02 square: P$1 6,0 | drill 1.02: P$2 3,0; P$3 0,0; P$4 -3,0; P$5 -6,0; P$6 6,3; P$7 3,3; P$8 0,3; P$9 -3,3; P$10 -6,3 | hole 1.02: 9,3.94; -9,3.94
1206L = smd 2.16 x 1.4: P$1 -1.85,0; P$2 1.85,0
SOIC127P600X175-8N = smd 1.525 x 0.7: 1 -2.712,1.905; 2 -2.712,0.635; 3 -2.712,-0.635; 4 -2.712,-1.905; 5 2.712,-1.905; 6 2.712,-0.635; 7 2.712,0.635; 8 2.712,1.905
TO255P460X1020X2008-3P = drill 1.32 pad 1.98 square: 1 0,0 | drill 1.32 pad 1.98: 2 2.55,0; 3 5.1,0
JP1 = drill 0.914 long: 1 0,-1.27; 2 0,1.27
R0805 = smd 1.3 x 1.5: 1 -0.95,0; 2 0.95,0
R0805' = smd 1.1 x 1.4: 1 -1,0; 2 1,0
MA04-1 = drill 1.016 long: 1 -3.81,0; 2 -1.27,0; 3 1.27,0; 4 3.81,0
MA03-1 = drill 1.016 long: 1 -2.54,0; 2 0,0; 3 2.54,0
MA06-1 = drill 1.016 long: 1 -6.35,0; 2 -3.81,0; 3 -1.27,0; 4 1.27,0; 5 3.81,0; 6 6.35,0
HSS10B20P40 = drill 2.45 pad 3.675 square: 1 0,0 | drill 2.45 pad 3.675: 2 24.2,0
MODULE_DEV-16771 = drill 0.8: 0 -26.67,-7.62; 1 -24.13,-7.62; 2 -21.59,-7.62; 3 -19.05,-7.62; 3.3V_1 6.35,-7.62; 3.3V_2 -24.13,7.62; 3.3V_3 16.51,-2.54; 4 -16.51,-7.62; 5 -13.97,-7.62; 6 -11.43,-7.62; 7 -8.89,-7.62; 8 -6.35,-7.62; 9 -3.81,-7.62; 10 -1.27,-7.62; 11 1.27,-7.62; 12 3.81,-7.62; 13 3.81,7.62; 14 1.27,7.62; 15 -1.27,7.62; 16 -3.81,7.62; 17 -6.35,7.62; 18 -8.89,7.62; 19 -11.43,7.62; 20 -13.97,7.62; 21 -16.51,7.62; 22 -19.05,7.62; 23 -21.59,7.62; 24 8.89,-7.62; 25 11.43,-7.62; 26 13.97,-7.62; 27 16.51,-7.62; 28 19.05,-7.62; 29 21.59,-7.62; 30 24.13,-7.62; 31 26.67,-7.62; 32 29.21,-7.62; 33 29.21,7.62; 34 26.67,7.62; 35 24.13,7.62; 36 21.59,7.62; 37 19.05,7.62; 38 16.51,7.62; 39 13.97,7.62; 40 11.43,7.62; 41 8.89,7.62; GND1 -29.21,-7.62; GND2 6.35,7.62; GND3 -26.67,7.62; GND4 16.51,0; ON/OFF 16.51,5.08; PROGRAM 16.51,2.54; VBAT 16.51,-5.08; VIN -29.21,7.62; VUSB -26.67,5.08 | drill 0.75: 5V -22.86,-4.57; D+ -17.78,-4.57; D- -20.32,-4.57; USB_GND1 -15.24,-4.57; USB_GND2 -12.7,-4.57 | drill 0.7: GND5 -14.24,3.17; LED -16.24,3.17; R+ -16.24,5.17; R- -14.24,5.17; T+ -14.24,1.17; T- -16.24,1.17
TSOP-6_PMOS = smd 0.5 x 1.92: 1 -1,-0.96; 6 -1,0.96 | smd 0.5 x 1.52: 2 0,-1.16; 5 0,1.16 | smd 0.635 x 1.27: D -0.5,0 | smd 0.75 x 1.2: G 1.13,-1.4; S 1.13,1.4
SO14_LONGPADS = smd 0.61 x 2.762: 1 -6.35,-1.61; 2 -5.08,-1.61; 3 -3.81,-1.61; 4 -2.54,-1.61; 5 -1.27,-1.61; 6 0,-1.61; 7 1.27,-1.61; 8 1.27,4.226; 9 0,4.226; 10 -1.27,4.226; 11 -2.54,4.226; 12 -3.81,4.226; 13 -5.08,4.226; 14 -6.35,4.226
SO8 = smd 0.66 x 2.032: 1 -1.905,-3.073; 2 -0.635,-3.073; 3 0.635,-3.073; 4 1.905,-3.073; 5 1.905,3.073; 6 0.635,3.073; 7 -0.635,3.073; 8 -1.905,3.073
SOD323HE = smd 1.092 x 0.787: ANODE- 0,0 | smd 1.092 x 2.007: CATHODE+ 0,-1.829
44769-0801 = drill 1.02 square: P$1 -4.5,0 | drill 1.02: P$2 -1.5,0; P$3 1.5,0; P$4 4.5,0; P$5 -4.5,3; P$6 -1.5,3; P$7 1.5,3; P$8 4.5,3 | hole 2.36: 7.5,3; -7.5,3
44769-1601 = drill 1.02 square: P$1 -10.5,0 | drill 1.02: P$2 -7.5,0; P$3 -4.5,0; P$4 -1.5,0; P$5 1.5,0; P$6 4.5,0; P$7 7.5,0; P$8 10.5,0; P$9 -10.5,3; P$10 -7.5,3; P$11 -4.5,3; P$12 -1.5,3; P$13 1.5,3; P$14 4.5,3; P$15 7.5,3; P$16 10.5,3 | hole 2.36: 13.5,3; -13.5,3
43045-0612 = drill 1.02 square: P$1 3,0 | drill 1.02: P$2 0,0; P$3 -3,0; P$4 3,3; P$5 0,3; P$6 -3,3 | hole 1.02: 6,3.94; -6,3.94
44769-1201 = drill 1.02 square: P$1 -7.5,0 | drill 1.02: P$2 -4.5,0; P$3 -1.5,0; P$4 1.5,0; P$5 4.5,0; P$6 7.5,0; P$7 -7.5,3; P$8 -4.5,3; P$9 -1.5,3; P$10 1.5,3; P$11 4.5,3; P$12 7.5,3 | hole 2.36: 10.5,3; -10.5,3

### Placement (x,y rotation side)
5V  36.7,5.59 270 top
12V  39.5,5.59 270 top
>95%ACU  80.14,36.07 180 top
AB  45.34,5.37 270 top
AE  42.29,5.37 270 top
BOOSTED_SUPPLY1  25.78,64.01 0 top
BTB_MC1  81.91,17.28 0 top
BTB_MC2  81.91,21.6 0 top
C1  65.66,74.43 0 top
C2  52.96,35.82 0 top
C3  23.24,22.36 270 top
C4  19.81,19.44 90 bottom
C5  68.71,66.05 270 top
C7  27.18,55.76 90 top
C8  8.13,49.54 270 top
C32  74.8,66.05 270 top
C34  52.2,68.84 90 top
C35  55.5,68.59 90 top
C36  80.14,70.11 0 bottom
C37  60.32,73.16 180 bottom
C+  80.14,32.01 180 top
C-  80.39,27.69 180 top
D1  81.15,65.79 0 top
D3  44.07,69.86 0 bottom
D4  14.86,52.33 270 top
D5  14.86,52.33 270 bottom
DATA_LOGGER  91.82,50.43 270 top
F1  10.03,19.06 180 bottom
F2  17.02,53.09 270 bottom
F3  17.02,52.58 270 top
F4  20.45,41.92 0 bottom
F5  20.7,34.8 0 bottom
F6  20.7,39.38 0 bottom
F7  20.7,37.09 0 bottom
F8  16.38,22.36 90 top
FRG_MC  37.46,69.86 270 top
IC2  44.07,38.87 90 top
IC3  43.82,61.98 90 top
IC4  22.1,9.02 180 top
IC8  20.96,49.16 90 top
IC9  20.96,49.28 90 bottom
IN_CAP  20.96,12.96 180 top
JP1  75.56,46.74 180 top
JP2  75.56,52.58 0 top
MC_AUX_OUTPUTS  12.83,63.76 90 top
OUT_CAP  14.6,13.21 180 top
R1  39.5,11.69 270 top
R2  5k  [R0805']  36.7,11.69 90 top
R3  5K  [R0805']  57.79,53.6 90 top
R4  10K  [R0805']  57.79,49.03 90 top
R5  5K  [R0805']  61.34,44.96 180 top
R6  10K  [R0805']  62.36,41.15 90 top
R7  10k  [R0805']  44.07,32.52 0 top
R8  10k  [R0805']  44.32,44.46 0 top
R11  10k  [R0805']  86.11,31.76 0 top
R12  10k  [R0805']  85.85,36.07 0 top
R13  10k  [R0805']  85.85,27.44 0 top
R14  10k  [R0805']  37.59,69.44 270 bottom
R16  10k  [R0805']  35.18,69.86 270 top
R17  29.34,20.45 180 bottom
R19  10k  [R0805']  37.97,41.41 270 top
R21  33.91,20.45 180 bottom
R22  10k  [R0805']  38.74,31.76 270 top
R23  10k  [R0805']  39.24,64.78 270 top
R24  10k  [R0805']  39.24,58.68 270 top
R25  1k  [R0805']  45.34,11.44 90 top
R27  10k  [R0805']  76.07,17.28 180 top
R28  10k  [R0805']  76.33,21.6 180 top
R29  4k7  [R0805']  58.04,64.01 270 bottom
R30  4k7  [R0805']  76.33,61.73 180 bottom
R31  10k  [R0805']  35.05,58.17 270 bottom
R32  10k  [R0805']  35.18,64.4 90 bottom
R33  1k  [R0805']  42.29,11.44 90 top
R34  10k  [R0805']  43.82,55.38 0 top
R36  10k  [R0805']  44.83,68.33 0 top
R52  10k  [R0805']  33.66,32.01 270 bottom
R53  10k  [R0805']  28.83,31.5 90 bottom
R54  60E  [R0805']  61.6,65.79 90 bottom
R55  60E  [R0805']  55.24,73.16 180 bottom
R56  60E  [R0805']  80.9,64.27 180 bottom
R57  60E  [R0805']  80.9,67.06 180 bottom
R61  100k  [R0805']  69.72,15.5 180 bottom
R62  100k  [R0805']  69.72,20.58 180 bottom
R63  100k  [R0805']  69.72,30.74 180 bottom
R64  100k  [R0805']  69.72,59.95 180 bottom
R65  100k  [R0805']  69.72,54.87 180 bottom
R66  100k  [R0805']  69.72,38.36 180 bottom
R67  100k  [R0805']  69.72,25.66 180 bottom
R68  100k  [R0805']  41.02,52.08 0 bottom
R69  100k  [R0805']  42.67,23.12 0 bottom
R70  100k  [R0805']  69.98,43.44 180 top
R71  100k  [R0805']  41.02,47.5 0 bottom
R72  100k  [R0805']  42.93,17.53 0 bottom
R73  100k  [R0805']  69.98,48.52 180 top
RFE_MC  41.02,69.6 270 top
SV2  31.12,23.37 180 top
SV3  33.4,51.7 90 top
SV4  75.31,34.8 90 top
U1  8,12.83 0 top
U2  57.02,42.17 270 top
U$1  19.68,21.85 0 top
U$2  56.52,53.6 90 bottom
U$7  72.01,65.54 90 bottom
U$8  54.99,68.84 90 bottom
U$13  16.13,20.07 180 bottom
U$14  35.69,58.43 0 top
U$15  35.69,64.52 0 top
U$16  34.16,32.26 0 top
U$17  28.83,31.5 180 top
U$20  72.52,67.57 0 top
U$24  69.72,30.74 90 top
U$25  69.72,38.36 90 top
U$26  69.72,20.58 90 top
U$27  69.72,15.5 90 top
U$28  69.72,54.87 90 top
U$29  69.72,59.95 90 top
U$30  69.72,25.66 90 top
U$31  41.02,52.08 270 top
U$32  42.67,23.12 270 top
U$33  69.98,43.44 90 bottom
U$34  41.02,48.01 270 top
U$35  42.93,17.53 270 top
U$36  69.98,48.52 90 bottom
X1  57.02,6.86 180 top
X2  14.86,-6.09 0 top  (outside the outline)
X3  86.49,67.82 270 top
X4  92.07,27.95 270 top

### Tracks (layer width: path | path; a pad name or v marks a point on that pad's centre or on a via)
2V5  (via drill 0.35)
  Top 0.406: IC3.5 45.72,62.74 44.45,61.47 IC3.3 44.45,58.55 v46.35,56.65 | IC2.3 44.7,37.73 | 44.7,37.73 45.85,38.87 45.85,41.45 IC2.5 46.61,42.22 v46.61,43.69 | SV2.3 29.85,26.68 31.62,28.45 31.62,35.06 34.29,37.73 44.7,37.73
  Bottom 0.406: v46.35,56.65 46.61,56.39 v46.61,43.69 | R21.1 R17.2 29.85,20.9 SV2.3
3V3  (via drill 0.35)
  Top 0.406: v66.68,59.7 68.06,61.08 U$29.S | v66.68,57.92 68.32,56.27 U$28.S | U$30.S 68.45,26.92 68.45,27.18 v69.47,28.2 | U$34.S 42.56,46.74 43.05,46.74 v43.82,47.5 | C34.2 v53.98,69.79 54.23,69.54 C35.2 60.26,69.54 v63.37,72.65 | v71.25,65.1 C5.2 | v71.25,65.1 72.45,65.1 72.52,65.03 U$20.CATHODE+ 73.16,65.1 C32.2 | v69.72,40.39 68.82,39.49 U$25.S | v68.96,33.28 68.32,32.64 U$24.S | v69.72,22.87 68.57,21.71 U$26.S | v69.98,18.04 68.57,16.63 U$27.S 68.21,16.52 v66.93,16.52 | v66.93,53.35 69.72,50.55 70.49,50.55 v70.49,50.43 | U$31.S 43.96,50.95 | v51.43,53.09 50.42,52.08 45.09,52.08 43.96,50.95 | 43.96,50.95 43.96,50.18 v43.82,50.04 | v71.25,65.1 71.25,67.57 v66.17,72.65 | U$35.S 47,16.4 v47.12,16.52 | v46.86,21.85 44.21,21.85 U$32.S
  Bottom 0.406: v66.68,59.7 v66.68,57.92 66.68,53.6 v66.93,53.35 | v66.68,59.7 55.75,59.7 54.91,58.85 U$2.7 U$2.6 53.09,53.6 52.97,53.72 52.07,53.72 v51.43,53.09 | v53.98,69.79 52.23,69.79 U$8.3 | U$7.3 70.17,66.17 v71.25,65.1 71.25,63 70.23,61.98 67.44,61.98 66.68,61.22 v66.68,59.7 | 73.03,45.22 73.03,48.77 72.15,49.65 U$36.S 71.26,49.65 v70.49,50.43 | 73.03,45.22 72.38,44.57 U$33.S | 73.03,45.22 73.03,41.41 | v69.72,40.39 72.01,40.39 73.03,41.41 | 73.03,41.41 73.03,35.82 | v68.96,33.28 70.49,33.28 73.03,35.82 | v69.47,28.2 72.01,28.2 73.03,29.22 | 73.03,29.22 73.03,28.45 | 73.03,28.45 73.03,23.63 | v69.72,22.87 72.26,22.87 73.03,23.63 | 73.03,23.63 73.03,18.8 72.26,18.04 v69.98,18.04 | v43.82,50.04 v43.82,47.5 | 73.03,35.82 73.03,29.22 | v66.93,16.52 v47.12,16.52 46.86,16.77 v46.86,21.85 | 73.03,28.45 SV4.1 75.56,28.45 79.63,24.39 88.13,24.39 X4.P$6 | v66.17,72.65 v63.37,72.65
3V3_TEENSY  (via drill 0.35)
  Top 0.406: U2.3.3V_1 C2.1 | v52.71,53.09 51.56,54.24 51.56,57.78 51.69,57.91 51.69,58.17 52.45,58.93 57.02,58.93 64.39,66.3 U2.3.3V_2
  Bottom 0.406: v52.71,53.09 53.47,52.33 U$2.5 56.77,52.33 57.79,51.31 57.79,44.2 U2.3.3V_1 54.48,30.74 U2.3.3V_3
5V  (1 unrouted)
  Top 0.406: C1.1 64.71,71.45 U2.VIN 63.12,71.38 56.77,65.03 U2.5V 51.43,65.03 50.67,65.79 50.67,73.16 48.39,75.44 10.68,75.44 3.94,68.7 3.94,41.71 | 5.4,33.42 5.4,24.2 15.55,14.04 OUT_CAP.1 17,11.77 IC4.3 19.41,6.61 30.62,6.61 R2.2 36.7,21.6 SV2.1
  Bottom 0.406: R21.2 34.86,23.31 SV2.1
12V  (via drill 0.35)
  Top 0.406: SV2.2 32.38,24.9 32.89,25.41 36.45,25.41 39.5,22.36 R1.1
  Top 0.61: U$14.S 39.1,59.83 | 39.1,59.83 R24.1 | U$15.S 36.96,65.78 R23.1 | R23.1 40.83,65.78 IC3.8 | R19.1 38.23,42.41 | 38.23,42.41 41.34,42.41 IC2.8 | R23.1 v39.24,67.32 | v39.24,61.73 39.24,59.97 39.1,59.83 | v38.23,44.2 38.23,42.41 | v38.23,35.57 38.23,32.52 36.7,32.52 35.56,33.66 U$16.S | 38.97,32.52 R22.1 | v63.12,61.47 64.13,62.49 78.1,62.49 80.39,60.2 80.39,51.57 84.53,47.43 DATA_LOGGER.P$2 | SV2.2 32.38,21.34 28.7,17.66 26.6,17.66 IN_CAP.1 22.1,12.77 IC4.1
  Bottom 0.61: v39.24,67.32 v39.24,61.73 | v39.24,61.73 39.24,54.11 38.23,53.09 v38.23,44.2 v38.23,35.57 38.23,30.74 32.38,24.9 SV2.2 | v39.24,61.73 40.01,62.49 50.54,62.49 51.81,61.22 62.87,61.22 v63.12,61.47 | IC4.1 21.84,9.28 21.84,11.55 17.26,16.13 U$13.S 19.63,18.67 C4.1
>95%_ACU  (via drill 0.35)
  Top 0.406: U$25.G 71.26,39.63 v72.26,39.63 73.28,38.61 73.28,37.6 74.8,36.07 SV4.4 77.34,38.11 84.96,38.11 86.85,36.22 R12.2 90.55,32.38 90.55,27.69 91.8,26.45 X4.P$4
  Bottom 0.406: v72.26,39.63 69.72,39.63 68.72,38.63 R66.1
>95%_FINAL_3V3_INV
  Top 0.406: U$25.2 70.68,38.16 U$25.1 70.18,37.86 U$25.D 69.26,37.86 U$25.6 68.76,38.16 U$25.5 67.47,38.36 65.66,40.17 65.66,42.68 64.9,43.44 U2.15
AB
  Top 0.406: R25.2 45.34,12.45 48.9,12.45 U2.32
AE
  Top 0.406: R33.2 42.29,13.47 42.8,13.98 47.88,13.98 U2.31
AUXILIARY_VOLTAGE_MC1
  Top 0.61: F3.P$1 17.02,54.23 D4.C 14.86,61.73 MC_AUX_OUTPUTS.1
AUXILIARY_VOLTAGE_MC2
  Bottom 0.61: F2.P$1 16.18,54.11 14.98,54.11 D5.C 6.98,54.23 4.95,56.26 4.95,62.91 5.8,63.76 MC_AUX_OUTPUTS.2
BOOSTED_SUPPLY  (1 unrouted)
  Top 0.61: 11.81,21.85 13.15,20.51 F8.P$1
  Bottom 0.61: 11.81,23.45 8.18,19.82 F1.P$1
BR_LIGHT_SIG
  Top 0.406: IC2.6 44.7,43.19 44.7,43.84 R8.2 45.59,44.73 45.59,47.5 46.61,48.52 U2.8
BR_LIGHT_SUPPLY
  Top 0.61: U$1.S 23.18,23.25 C3.1 23.24,25.64 U$17.S
BTB_FROM_MC1  (via drill 0.35)
  Top 0.406: U$27.G 71.26,16.77 v72.26,16.77 72.77,17.28 R27.2 76.85,15.5 85.47,15.5 88.26,18.29 93.34,18.29 95.07,20.02 X4.P$12
  Bottom 0.406: v72.26,16.77 69.72,16.77 68.72,15.77 R61.1
BTB_FROM_MC1_3V3_INV
  Top 0.406: U2.34 U$27.5 68.76,15.3 U$27.6 69.26,15 U$27.D 70.18,15 U$27.1 70.68,15.3 U$27.2
BTB_FROM_MC2  (via drill 0.35)
  Top 0.406: U$26.G 71.26,21.85 v72.26,21.85 75.07,21.85 R28.2 75.33,19.8 76.07,19.06 88.26,19.06 91.31,22.1 93.73,22.1 X4.P$11
  Bottom 0.406: v72.26,21.85 69.72,21.85 68.72,20.85 R62.1
BTB_FROM_MC2_3V3_INV
  Top 0.406: U2.35 66.18,19.58 U$26.6 | U$26.5 68.56,19.78 U$26.6 | U$26.6 69.26,20.08 U$26.D 70.22,19.58 U$26.1 70.68,20.38 U$26.2
C+  (via drill 0.35)
  Top 0.406: U$24.G 71.26,32.01 v72.26,32.01 73.79,33.53 SV4.3 75.82,34.04 84.82,34.04 R11.2 89.03,31.76 89.28,31.5 89.28,27.44 91.57,25.15 94.62,25.15 95.07,25.61 X4.P$10
  Bottom 0.406: v72.26,32.01 69.72,32.01 68.72,31.01 R63.1
C+_3V3_INV
  Top 0.406: 68.72,29.74 U$24.6 69.26,30.24 U$24.D 70.18,30.24 U$24.1 70.68,30.54 U$24.2 | U$24.5 68.72,30.58 68.72,29.74 | 68.72,29.74 66.93,27.95 66.93,25.41 U2.37
C-  (via drill 0.35)
  Top 0.406: U$30.G 71.26,26.93 v72.26,26.93 72.95,27.62 72.95,29.67 74.27,30.99 SV4.2 76.33,29.98 84.31,29.98 R13.2 87.07,27.44 91.06,23.45 X4.P$5
  Bottom 0.406: v72.26,26.93 69.72,26.93 68.72,25.93 R67.1
C-_3V3_INV
  Top 0.406: U2.36 68.72,24.66 | 68.72,24.66 U$30.6 69.26,25.16 U$30.D 70.18,25.16 U$30.1 70.68,25.46 U$30.2 | U$30.5 68.72,25.5 68.72,24.66
C_CAN_H  (via drill 0.35)
  Top 0.406: v77.34,64.78 80.04,64.78 D1.2 86.47,64.84 X3.P$1
  Bottom 0.406: U$7.7 77.22,64.9 v77.34,64.78 77.85,64.27 R56.1 79.9,59.43 86.49,52.84 91.23,52.84 DATA_LOGGER.P$4
C_CAN_L  (via drill 0.35)
  Top 0.406: v77.34,66.81 80.04,66.81 D1.1 81.18,67.82 X3.P$2
  Bottom 0.406: U$7.6 76.71,66.17 v77.34,66.81 77.6,67.06 R57.1 | X3.P$2 88.26,66.05 88.26,55.89 89.28,54.87 93.85,54.87 94.82,53.9 DATA_LOGGER.P$9
C_RX
  Bottom 0.406: U2.23 64.64,64.01 68.2,67.57 68.81,67.57 U$7.4
C_TX
  Bottom 0.406: U2.22 67.06,63.63 U$7.1
D_CAN_H
  Bottom 0.406: D3.2 48.61,72.4 52.71,72.4 56.9,68.21 U$8.7 59.18,68.21 60.07,67.32 60.07,65.03 60.31,64.79 R54.1 63.12,66.32 63.12,69.14 64.34,70.36 75.82,70.36 77.34,71.89 85.42,71.89 X3.P$3 87.71,69.6 90.81,69.6 92.33,68.08 92.33,61.17 92.33,58.17 92.33,56.93 DATA_LOGGER.P$5
D_CAN_L
  Bottom 0.406: 54.24,72.9 R55.1 54.24,74.17 55.01,74.94 84.61,74.94 88.72,70.82 X3.P$6 91.62,70.82 94.29,68.15 94.29,56.96 DATA_LOGGER.P$10 | 54.24,72.9 54.24,72.4 54.48,72.16 54.48,72.14 57.15,69.48 U$8.6 | D3.1 45.12,70.91 47.88,73.67 53.48,73.67 54.24,72.9
D_RX
  Bottom 0.406: U$8.4 50.55,70.75 49.4,69.6 U2.0
D_TX
  Bottom 0.406: U$8.1 50.04,66.94 U2.1
DASH_B1
  Top 0.406: X3.P$5 91.82,67.82 92.33,67.32 92.33,59.31 93.34,58.29 93.34,51.9 DATA_LOGGER.P$8
DASH_B2
  Top 0.406: X3.P$4 87.25,62.59 82.93,58.27 82.93,51.57 84.71,49.79 91.19,49.79 DATA_LOGGER.P$3
DL_B1
  Top 0.406: U2.11 49.4,40.65 51.18,38.87 53.98,38.87 56.09,36.75 56.09,24.51 57.02,23.58 57.02,2.8 57.6,2.23 65.59,2.23 77.34,13.98 94.36,13.98 96.97,16.58 96.97,42.28 DATA_LOGGER.P$6
DL_B2  (via drill 0.35)
  Top 0.406: U2.10 51.43,43.44 58.29,36.58 v58.29,29.72 | v59.31,18.04 v59.31,14.74
  Bottom 0.406: v58.29,29.72 58.29,28.28 58.13,28.11 58.13,20.49 59.31,19.31 v59.31,18.04 | v59.31,14.74 62.36,11.69 92.58,11.69 96.97,16.07 96.97,45.28 DATA_LOGGER.P$7
DOUT1_MC1  (via drill 0.35)
  Top 0.406: v40.77,50.3 40.27,50.3 U$31.G 39.62,50.93 25.23,36.53 15.62,36.53 12.32,39.84
  Bottom 0.406: v40.77,50.3 42.02,51.55 R68.1
DOUT1_MC1_3V3
  Top 0.406: U$31.2 39.75,52.08 40.06,52.39 U$31.1 40.56,52.58 U$31.D 41.48,52.58 U$31.6 41.98,52.28 U$31.5 42.8,52.08 43.82,53.09 48.9,53.09 U2.6
DOUT1_MC2  (via drill 0.35)
  Top 0.406: v40.77,46.23 40.27,46.23 U$34.G 37.35,46.88 26.04,35.57 15.11,35.57 12.11,38.57 10.08,38.57
  Bottom 0.406: v40.77,46.23 42.02,47.49 R71.1
DOUT1_MC2_3V3
  Top 0.406: U$34.2 40.06,48.21 U$34.1 40.56,48.51 U$34.D 41.48,48.51 U$34.6 41.98,48.21 U$34.5 42.8,48.01 45.85,51.06 U2.7
DOUT2_MC1  (via drill 0.35)
  Top 0.406: U$32.G 41.27,20.96 40.96,20.64 v40.89,20.58
  Bottom 0.406: R69.1 43.43,23.12 v40.89,20.58 38.61,18.29 27.05,18.29 14.51,30.84
DOUT2_MC1_3V3
  Top 0.406: U$32.2 41.51,23.92 U$32.1 42.17,24.12 U$32.D 43.13,23.62 U$32.6 43.63,23.32 U$32.5 U2.28
DOUT2_MC2  (via drill 0.35)
  Top 0.406: U$35.G 42.6,15.33 42.93,15.33 v42.93,15.5
  Bottom 0.406: R72.1 42.93,16.53 v42.93,15.5 37.59,15.5 36.07,17.03 26.29,17.03 13.84,29.47 10.18,29.47
DOUT2_MC2_3V3
  Top 0.406: U$35.2 41.97,17.73 U$35.1 41.66,18.53 42.16,18.03 U$35.D 43.39,18.03 U$35.6 43.89,17.73 U$35.5 45.59,17.53 48.64,20.58 U2.29
DOUT3_MC1  (via drill 0.35)
  Top 0.406: v67.44,44.71 69.98,44.71 70.98,43.71 R70.1 73.28,41.14 73.28,40.14 74.8,38.61 SV4.5
  Bottom 0.406: U$33.G 68.44,44.71 v67.44,44.71 | SV4.5 85.98,27.95 94.11,27.95 95.07,28.91 X4.P$9
DOUT3_MC1_3V3
  Bottom 0.406: U$33.5 71.14,42.55 71.25,42.44 U$33.6 70.44,42.94 U$33.D 69.52,42.94 U$33.1 69.02,43.24 U$33.2 67.44,43.44 64.9,45.98 U2.16
DOUT3_MC2  (via drill 0.35)
  Top 0.406: v67.44,49.79 69.98,49.79 70.98,48.79 R73.1 72.26,48.52 74.04,46.74 76.84,46.74 78.1,45.47 78.1,41.66 77.6,41.15 SV4.6
  Bottom 0.406: U$36.G 68.44,49.79 v67.44,49.79 | X4.P$3 87.78,29.45 76.07,41.15 SV4.6
DOUT3_MC2_3V3
  Bottom 0.406: U$36.5 71.14,47.68 70.98,47.52 U$36.6 70.44,48.02 U$36.D 69.52,48.02 U$36.1 69.02,48.32 U$36.2 U2.17
DRIVER_SELECT  (via drill 0.35)
  Top 0.406: U$29.G 71.26,61.22 v72.26,61.22
  Bottom 0.406: R64.1 68.72,60.22 69.72,61.22 v72.26,61.22 80.14,53.35 80.14,47 90.3,36.84 93.69,36.84 X4.P$7
DRIVER_SELECT_3V3_INV
  Top 0.406: U2.21 64.91,58.95 U$29.6 | U$29.5 68.56,59.15 U$29.6 | U$29.6 69.26,59.45 U$29.D 70.18,59.45 U$29.1 70.68,59.75 U$29.2
ECU_MC_ERR_SIG  (via drill 0.35)
  Top 0.406: v41.02,44.71 40.77,44.96 37.21,44.96 26.8,34.55 14.1,34.55
  Bottom 0.406: U2.9 49.4,44.96 46.86,42.42 43.31,42.42 v41.02,44.71
FRG
  Top 0.406: IC3.6 44.45,65.41 45.09,66.05 46.1,66.05 | 46.1,66.05 47.12,66.05 U2.2 | R36.2 46.1,68.06 46.1,67.06 46.1,66.05
FRG_MC  (via drill 0.35)
  Top 0.406: 35.19,64.98 U$15.6 34.88,65.48 35.19,65.79 | U$15.1 34.69,64.02 34.93,64.26 | 34.93,64.26 U$15.D | U$15.2 35.69,64.02 U$15.D | U$15.D 35.19,64.98 | 35.19,65.18 35.19,65.54 | 35.19,65.54 35.19,65.79 | 35.19,65.79 35.19,66.18 U$15.5 | R16.2 35.19,68.85 35.18,68.84 v35.18,67.06 35.69,66.55 U$15.5 | U$15.5 35.33,65.68 35.19,65.54 | U$15.5 35.19,65.18 | 35.19,65.18 35.19,64.98 | v24.26,41.92 31.37,49.03 31.37,60.97 34.67,64.26 34.93,64.26
  Bottom 0.406: R32.2 v35.18,67.06 | F6.P$1 22.02,39.91 22.02,41.15 22.02,41.64 | 22.02,41.64 22.02,41.7 | v24.26,41.92 F4.P$1 22.02,41.64
FRG_MC1
  Bottom 0.406: F6.P$2 18.67,39.38 13.59,44.46 10.19,44.46
FRG_MC2
  Bottom 0.406: 14.68,45.84 F4.P$2
GND  (via drill 0.35, 4.32 pad 0.95)  (82 unrouted)
  other vias: 81.66,25.66 85.22,17.28 73.03,58.43 60.58,71.63 77.09,32.26 53.72,66.05 95.12,73.92 95.12,5.34 3.18,74.17
  pour Top (isolate 0.254): 0.13,77.22 98.93,77.22 98.93,0.01 0.13,0.01
  pour Bottom (isolate 0.254): -0.13,77.98 99.19,77.98 99.19,0.51 -0.13,0.51
IGNITION_SWITCH  (via drill 0.35)
  Top 0.406: U$28.G 71.26,56.14 v72.26,56.14
  Bottom 0.406: R65.1 68.72,55.14 69.72,56.14 v72.26,56.14 76.07,56.14 78.87,53.35 78.87,46.49 89.91,35.45 X4.P$1
IGNITION_SWITCH_3V3_INV
  Top 0.406: U2.20 65.91,56.14 67.18,54.87 U$28.5 68.76,54.67 U$28.6 69.26,54.37 U$28.D 70.18,54.37 U$28.1 70.68,54.67 U$28.2
LC_RL
  Top 0.406: U2.41 58.02,26.65 58.02,7.37 X1.P$2
LC_RR
  Top 0.406: U2.40 60.58,26.68 60.58,8.43 59.92,7.77 59.92,5.26 X1.P$6
MC_1
  Top 0.61: IC8.2 IC8.1 17.02,46.44 F3.P$2 | C7.+ 23.88,51.19 23.88,50.68 20.32,47.12 IC8.2 | IC8.2 IC8.3
  Bottom 0.61: SV3.3 33.15,54.49 C7.+
MC_2
  Bottom 0.61: SV3.1 30.35,49.16 28.7,50.81 C8.+ 12.36,46.57 IC9.1 IC9.2 IC9.3 20.32,45.35 19.94,44.96 18.67,44.96 17.02,46.62 F2.P$2
N$1
  Top 0.406: R1.2 12V.A
N$2  (via drill 0.35)
  Top 0.406: v39.5,71.63 40.41,71.63 RFE_MC.A
  Bottom 0.406: R14.1 38.78,71.63 v39.5,71.63
N$3
  Top 0.406: R25.1 AB.A
N$4
  Top 0.406: R16.1 35.6,71.28 FRG_MC.A
N$5
  Top 0.406: U$16.G 38.63,30.86 R22.2 39.26,30.76 42.16,33.66 IC2.1
N$6
  Top 0.406: R2.1 5V.A
N$7
  Top 0.406: IC2.7 43.43,40.01 42.55,39.12 39.26,39.12 R19.2 37.96,40.39 34.16,40.39 27.7,33.93 U$17.G
N$8
  Top 0.406: R33.1 AE.A
N$10
  Top 0.406: U$1.6 19.18,22.31 U$1.D | U$1.5 19.68,22.35 U$1.D | U$1.1 18.68,21.35 U$1.D | U$1.2 19.68,21.35 U$1.D
  Top 0.61: F8.P$2 18.74,21.85 U$1.D
N$15
  Top 0.406: C+.A 81.81,31.76 R11.1
N$16
  Top 0.406: R12.1 >95%ACU.A
N$17
  Top 0.406: R13.1 82.07,27.44 C-.A
N$18
  Top 0.406: R27.1 BTB_MC1.A
N$31
  Top 0.406: BTB_MC2.A R28.1
N$32
  Bottom 0.406: R29.1 56.79,65.01 56.26,65.54 56.26,66.55 56.64,66.94 U$8.8
N$33
  Bottom 0.406: R54.2 60.58,67.81 60.58,69.86 59.69,70.75 U$8.5 57.94,70.62 57.28,70.62 56.24,71.65 R55.2 C37.1
N$35
  Bottom 0.406: U$7.5 76.35,68.71 80.45,68.71 81.09,69.35 C36.1 81.14,69.07 81.51,68.72 81.9,68.33 R57.2 R56.2 | R56.2 81.9,63.78 81.91,63.76 81.91,64.25 R56.2
N$37
  Bottom 0.406: U$7.8 75.08,61.97 R30.1
N$46
  Bottom 0.406: U$13.6 15.13,19.57 15.5,19.94 | 15.5,19.94 U$13.D | U$13.1 15.5,20.66 15.5,19.94 | U$13.5 15.5,19.54 | 15.5,19.54 15.5,19.94 | U$13.2 16.13,20.17 15.5,19.54
  Bottom 0.61: U$13.6 15.18,19.06 F1.P$2
NET1  (via drill 0.35)
  Top 0.406: R3.2 57.79,54.79 58.88,55.89 v59.31,55.89
  Bottom 0.406: U$2.9 U$2.8 60.07,54.87 60.07,55.12 v59.31,55.89
NET2  (via drill 0.35)
  Top 0.406: R5.2 60.34,46.25 v60.58,46.49
  Bottom 0.406: U$2.14 60.74,47.5 | 60.74,47.5 U$2.13 | v60.58,46.49 60.58,47.34 60.74,47.5
RFE
  Top 0.406: IC3.2 43.18,57.92 43.18,57.54 44.82,55.9 R34.2 45.07,55.12 46.61,55.12 47.63,56.14 47.63,59.95 48.9,61.22 U2.3
RFE_MC  (via drill 0.35)
  Top 0.406: U$14.D 35.19,57.77 U$14.2 v35.69,55.12 35.94,54.87 35.94,48.77 25.27,38.11 v25.02,38.11 | U$14.1 35.19,57.97 U$14.D | U$14.6 35.19,58.89 U$14.D | U$14.D 35.19,59.09 U$14.5
  Bottom 0.406: R31.2 35.69,56.54 | 35.69,56.54 35.76,56.47 35.5,56.47 37.59,58.55 R14.2 | F5.P$1 F7.P$1 22.8,37.34 24.26,37.34 v25.02,38.11 | 35.69,56.54 v35.69,55.12
RFE_MC1
  Bottom 0.406: 9.99,41.66 12.07,41.66 16.89,36.84 16.89,35.57 17.65,34.8 F5.P$2
RFE_MC2
  Bottom 0.406: 13.1,42.84 F7.P$2
RTDS_SIG
  Top 0.406: IC2.2 43.43,34.68 45.07,33.04 R7.2 46.61,32.52 47.37,33.28 47.37,36.33 U2.12
SENS_1/SCL
  Bottom 0.406: U$2.10 64.9,52.33 65.41,51.82 75.06,51.82 JP2.1 77.34,49.54 77.34,46.23 90.04,33.54 92.53,33.54 92.54,33.53 93.99,33.53 X4.P$8
SENS_1/SCL_OUT
  Top 0.406: R4.2 R3.1 63.64,52.6 U2.19
  Bottom 0.406: U2.19 65.66,52.58 73.28,52.58 74.55,53.85 JP2.2
SENS_1/SDA  (via drill 0.35)
  Top 0.406: v63.12,49.79 65.15,49.79 66.93,48.01 66.93,47 68.45,45.47 JP1.2
  Bottom 0.406: U$2.12 v63.12,49.79 | JP1.2 88.59,32.45 X4.P$2
SENS_1/SDA_OUT  (via drill 0.35)
  Top 0.406: v63.37,48.52 63.37,46 R5.1 62.36,44.95 R6.2
  Bottom 0.406: JP1.1 72.52,51.06 U2.18 64.64,49.84 63.71,48.91 63.71,48.86 v63.37,48.52
SG_LR1
  Top 0.406: U2.25 49.4,30.49 53.34,26.55 53.34,24.52 53.72,24.14 53.72,5.67 X1.P$7
SG_LR2
  Top 0.406: X1.P$3 55.41,6.97 55.41,27.27 U2.24
SG_RR1
  Top 0.406: U2.27 50.42,24.64 50.42,5.97 X1.P$8
SG_RR2
  Top 0.406: U2.26 51.01,26.59 51.01,25.28 51.43,24.85 51.43,7.95 X1.P$4
SUPPLY_MC
  Top 0.61: IC8.8 IC8.7 IC8.6 IC8.5 25.78,54.79 BOOSTED_SUPPLY1.1
  Bottom 0.61: BOOSTED_SUPPLY1.1 25.78,54.92 IC9.8 IC9.7 IC9.6 IC9.5
SUS_RL
  Top 0.406: U2.39 63.03,26.59 63.03,25.28 62.1,24.34 62.1,7.44 X1.P$1
SUS_RR
  Top 0.406: U2.38 63.12,24.14 63.12,5.46 X1.P$5
TO_BR_LIGHT  (via drill 0.35)
  Top 0.406: U$17.5 29.03,30.54 U$17.6 29.33,31.04 U$17.D 29.83,32 U$17.1 29.03,32.46 U$17.2 28.83,33.79 v29.08,34.04
  Bottom 0.406: v29.08,34.04 29.08,32.76 R53.2
  Bottom 0.508: R53.2 17.45,32.5 14.64,35.31 9.52,35.31 8.81,34.6
TO_FRG_ENABLE
  Top 0.305: IC3.7 43.18,63.63 41.78,62.24 40.78,62.24 R23.2 38.59,63.12 U$15.G
TO_RFE_ENABLE
  Top 0.406: IC3.1 41.8,59.17 41.8,58.19 41.02,57.41 39.51,57.41 R24.2 39.11,57.55 38.74,57.92 37.21,57.92 36.82,57.52 U$14.G
TO_RTDS  (via drill 0.35)
  Top 0.406: U$16.5 33.96,33.22 U$16.6 33.66,32.47 U$16.D 33.66,31.8 U$16.1 33.96,31.3 U$16.2 v34.16,28.71
  Bottom 0.406: R52.2 33.66,29.22 v34.16,28.71 31.37,25.91 21.97,25.91 14.1,33.79 14.15,33.79 14.1,33.84
USB_GND
  Bottom 0.406: U2.USB_GND1 U2.USB_GND2

### Text on the board
tPlace: GND | SUPPLY_MC | MC_2 | MC_1 | FRG | RFE | 12V | 5V | 2V5 | GND | DOUT1_ / MC2 | DOUT1_ / MC1 | ECU_MC / _ERR | 5V | RTDS_ / SIG | BR_ / LIGHT | DOUT2 / _MC1 | DOUT2_ / MC2 | BOOST | GND | ECU_2025 | Designed by / Sruthi & Suyash